# Altium project Brautomation_V2.PrjPcb (part 1 of 2)
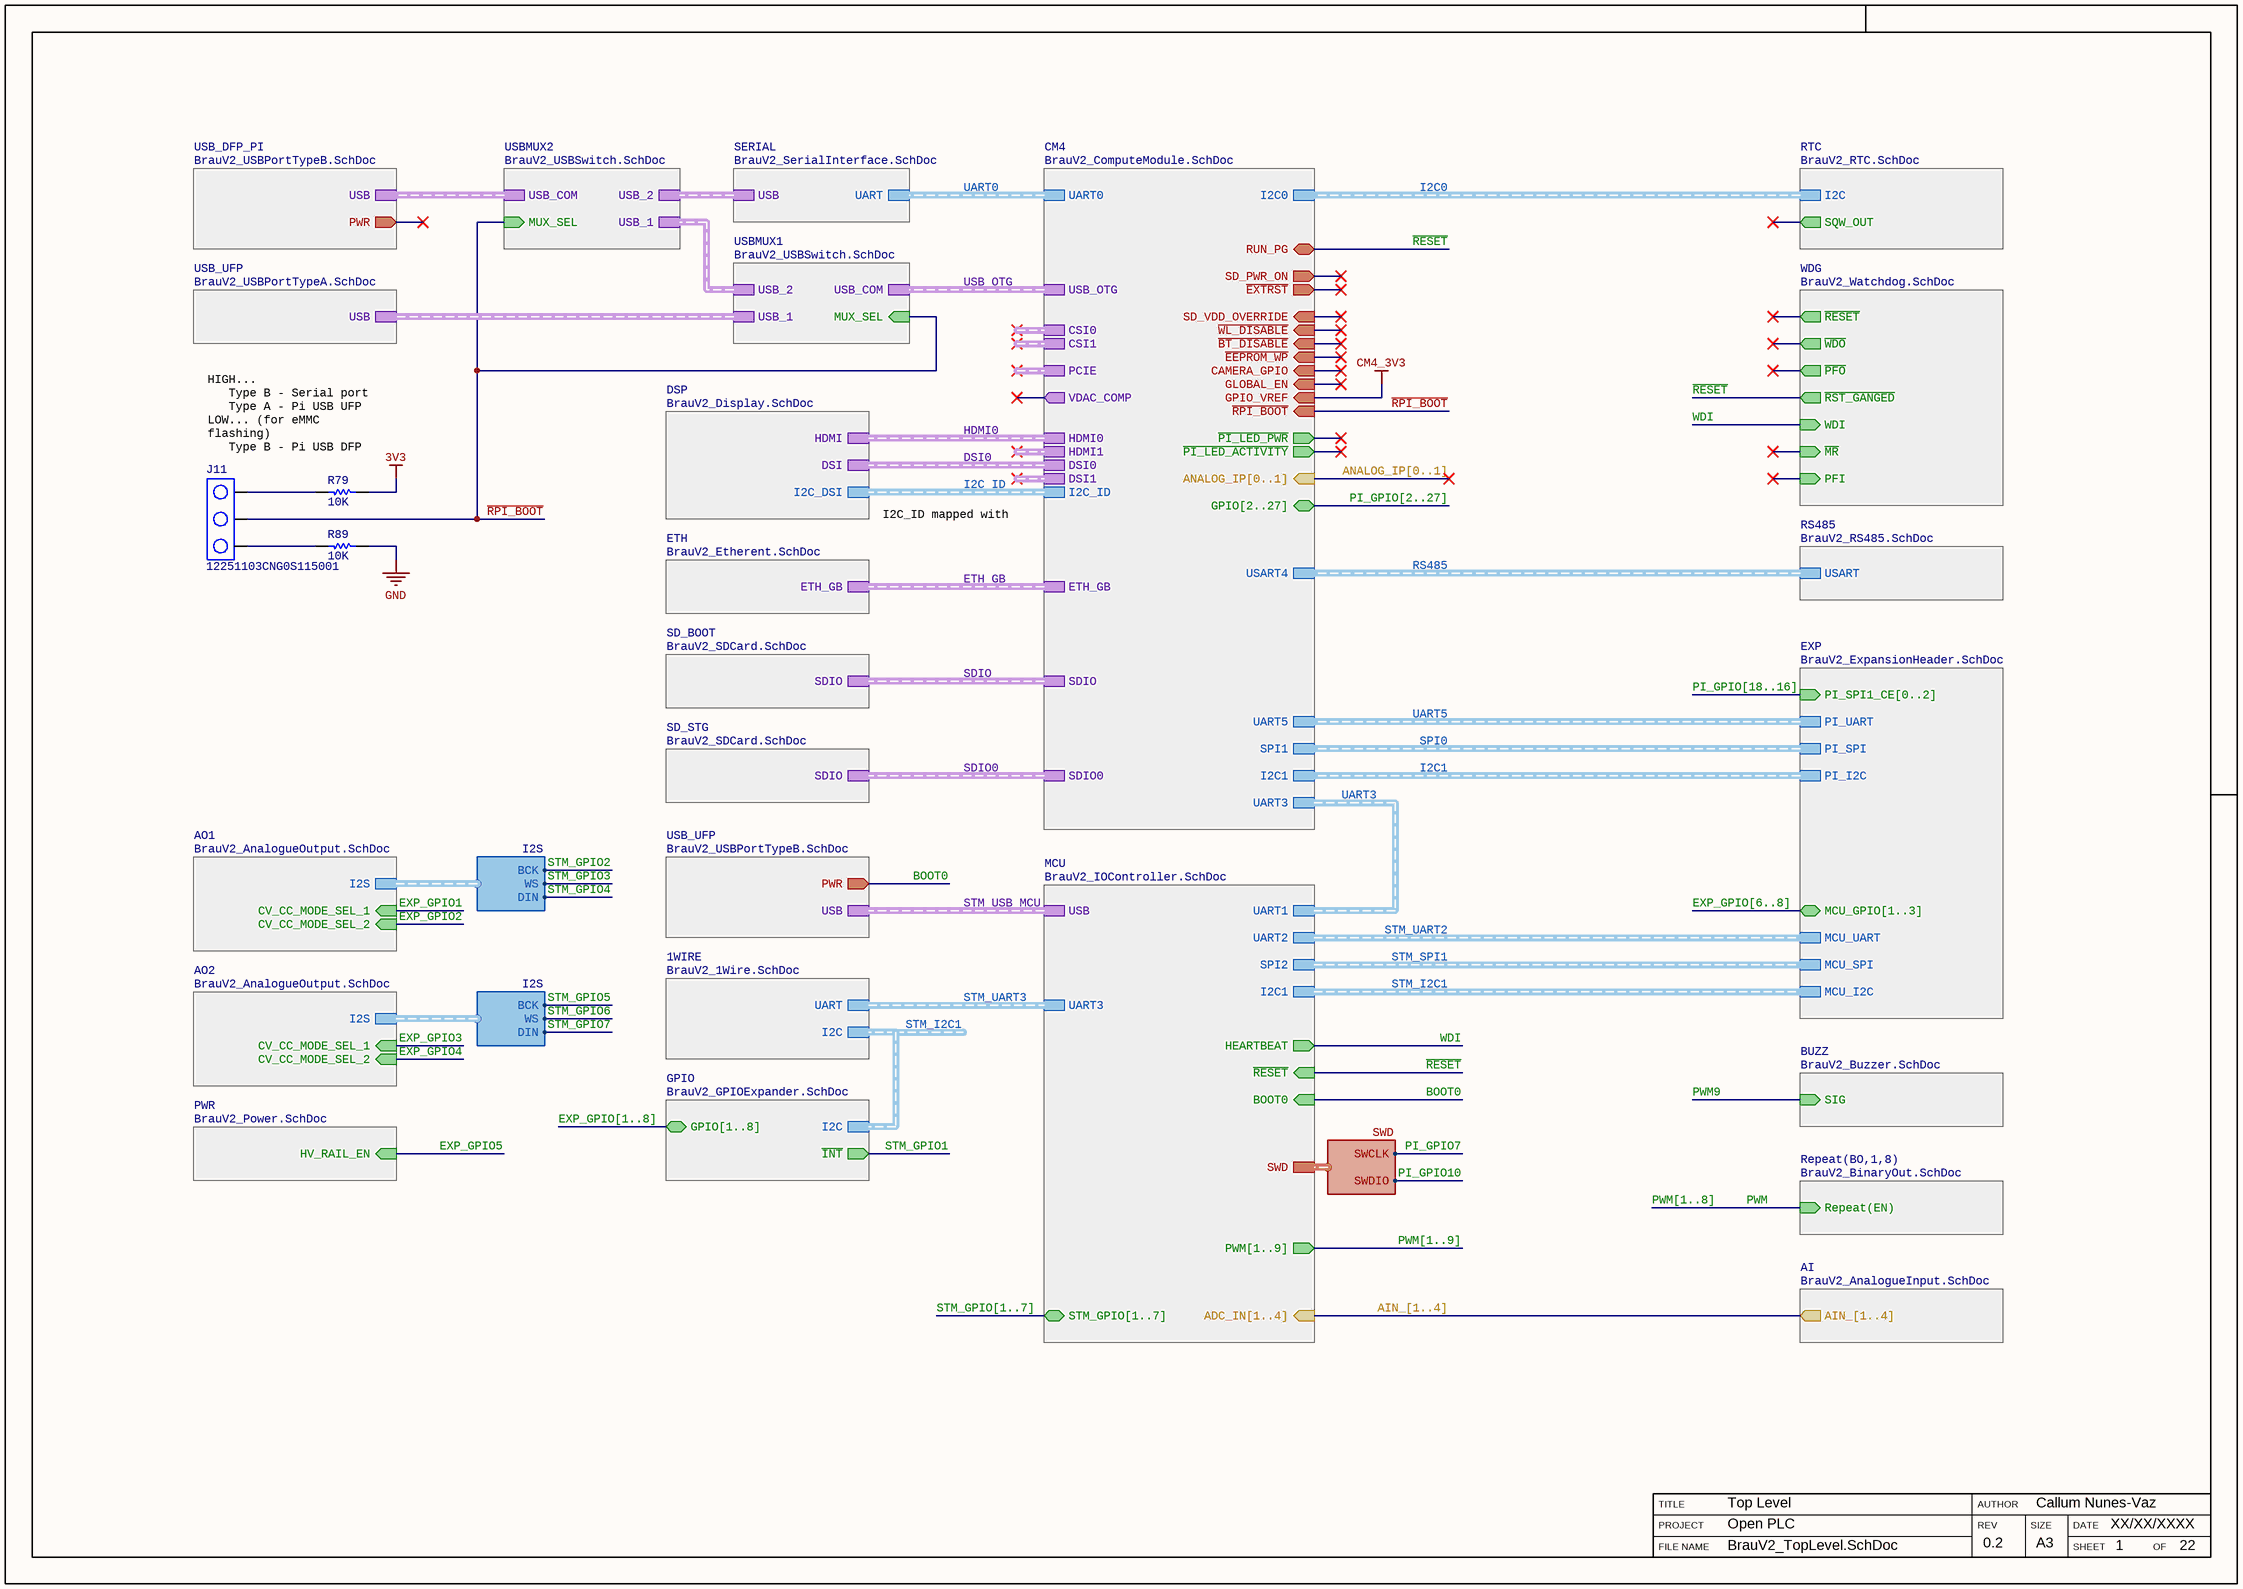
[diagram p0: BrauV2_TopLevel.SchDoc]
ProjectTitle: Open PLC; ProjectRevision: 0.2; ProjectDate: XX/XX/XXXX; AuthorName: Callum Nunes-Vaz
13 sheets, 241 parts. Net scope: hierarchical (ports join the sheet entries above them; power ports are global).
Board files: BrauV2.PcbDoc, BrauV2_PANEL.PcbDoc
Sheets:
  BrauV2_TopLevel.SchDoc
    CM4 = BrauV2_ComputeModule.SchDoc
    AO1 = BrauV2_AnalogueOutput.SchDoc
    AO2 = BrauV2_AnalogueOutput.SchDoc
    MCU = BrauV2_IOController.SchDoc
    USBMUX1 = BrauV2_USBSwitch.SchDoc
    USBMUX2 = BrauV2_USBSwitch.SchDoc
    BUZZ = BrauV2_Buzzer.SchDoc
    AI = BrauV2_AnalogueInput.SchDoc
    DSP = BrauV2_Display.SchDoc
    ETH = BrauV2_Etherent.SchDoc
    PWR = BrauV2_Power.SchDoc
    1WIRE = BrauV2_1Wire.SchDoc
    GPIO = BrauV2_GPIOExpander.SchDoc
    RS485 = BrauV2_RS485.SchDoc

## Sheet BrauV2_TopLevel.SchDoc
size 420 x 297 mm; PageSetup: Record=PageOptions|CenterHorizontal=True|CenterVertical=True|PrintScale=1.01|XCorrection=1.00|YCorrection=1.00|PrintKind=1|BorderSize=5000000|LeftOffset=0|BottomOffset=0|Orientation=2|PaperLength=1000|PaperWidth=1000|Scale=100|PaperSource=7|PrintQuality=-4|MediaType=1|DitherType=10|PaperKind=A3|PrintScaleMode=1; Author: Callum Nunes-Vaz; DocumentNumber: 1; SheetNumber: 1; SheetTotal: 22; SheetTitle: Top Level

### Parts
J11  12251103CNG0S115001  [Header_3POS]
R79  Resistance: 10K  [SMD_RES_0402(1005)_N]  (hidden comment: RC0402FR-0710KL)
R89  Resistance: 10K  [SMD_RES_0402(1005)_N]  (hidden comment: RC0402FR-0710KL)

### Sub-sheets
1WIRE = BrauV2_1Wire.SchDoc: I2C (harness I2C), UART (harness UART)
AI = BrauV2_AnalogueInput.SchDoc: AIN_[1..4] (out)
AO1 = BrauV2_AnalogueOutput.SchDoc: CV_CC_MODE_SEL_1 (in), I2S (harness I2S), CV_CC_MODE_SEL_2 (in)
AO2 = BrauV2_AnalogueOutput.SchDoc: CV_CC_MODE_SEL_1 (in), I2S (harness I2S), CV_CC_MODE_SEL_2 (in)
BUZZ = BrauV2_Buzzer.SchDoc: SIG (in)
CM4 = BrauV2_ComputeModule.SchDoc: ANALOG_IP[0..1] (in), USB_OTG (harness USB), I2C1 (harness I2C), VDAC_COMP (out), PCIE (harness PCIE), CSI1 (harness MIPI_CSI_4L), CSI0 (harness MIPI_CSI_2L), GPIO[2..27] (bidir), RUN_PG (bidir), HDMI0 (harness HDMI), DSI0 (harness MIPI_DSI_2L), SDIO (harness SDIO_X8), HDMI1 (harness HDMI), ETH_GB (harness ETH_GP), DSI1 (harness MIPI_DSI_4L), I2C_ID (harness I2C), UART0 (harness UART), UART3 (harness UART), I2C0 (harness I2C), SDIO0 (harness SDIO_X8), UART5 (harness UART), SPI1 (harness SPI), USART4 (harness USART), SD_PWR_ON (out), ~{EXTRST} (out), GLOBAL_EN (in), ~{RPI_BOOT} (in), CAMERA_GPIO (in), ~{WL_DISABLE} (in), ~{EEPROM_WP} (in), ~{BT_DISABLE} (in), SD_VDD_OVERRIDE (in), GPIO_VREF (in), ~{PI_LED_ACTIVITY} (out), ~{PI_LED_PWR} (out)
DSP = BrauV2_Display.SchDoc: I2C_DSI (harness I2C), HDMI (harness HDMI), DSI (harness MIPI_DSI_4L)
ETH = BrauV2_Etherent.SchDoc: ETH_GB (harness ETH_GP)
EXP = BrauV2_ExpansionHeader.SchDoc (file not in this document): MCU_I2C (harness I2C), MCU_UART (harness UART), MCU_SPI (harness SPI), PI_SPI1_CE[0..2] (in), PI_I2C (harness I2C), PI_UART (harness UART), PI_SPI (harness SPI), MCU_GPIO[1..3] (bidir)
GPIO = BrauV2_GPIOExpander.SchDoc: I2C (harness I2C), GPIO[1..8] (bidir), ~{INT} (out)
MCU = BrauV2_IOController.SchDoc: ADC_IN[1..4] (in), STM_GPIO[1..7] (bidir), UART1 (harness UART), UART2 (harness UART), SPI2 (harness SPI), SWD (harness SWD), PWM[1..9] (out), BOOT0 (in), USB (harness USB), UART3 (harness UART), I2C1 (harness I2C), ~{RESET} (in), HEARTBEAT (out)
PWR = BrauV2_Power.SchDoc: HV_RAIL_EN (in)
Repeat(BO,1,8) = BrauV2_BinaryOut.SchDoc (file not in this document): Repeat(EN) (in)
RS485 = BrauV2_RS485.SchDoc: USART (harness USART)
RTC = BrauV2_RTC.SchDoc (file not in this document): SQW_OUT (out), I2C (harness I2C)
SD_BOOT = BrauV2_SDCard.SchDoc (file not in this document): SDIO (harness SDIO_X8)
SD_STG = BrauV2_SDCard.SchDoc (file not in this document): SDIO (harness SDIO_X8)
SERIAL = BrauV2_SerialInterface.SchDoc (file not in this document): UART (harness UART), USB (harness USB)
USB_DFP_PI = BrauV2_USBPortTypeB.SchDoc (file not in this document): USB (harness USB), PWR (out)
USB_UFP = BrauV2_USBPortTypeA.SchDoc (file not in this document): USB (harness USB)
USB_UFP = BrauV2_USBPortTypeB.SchDoc (file not in this document): USB (harness USB), PWR (out)
USBMUX1 = BrauV2_USBSwitch.SchDoc: USB_COM (harness USB), USB_1 (harness USB), USB_2 (harness USB), MUX_SEL (in)
USBMUX2 = BrauV2_USBSwitch.SchDoc: USB_COM (harness USB), USB_1 (harness USB), USB_2 (harness USB), MUX_SEL (in)
WDG = BrauV2_Watchdog.SchDoc (file not in this document): PFI (in), ~{MR} (in), WDI (in), ~{PFO} (out), ~{WDO} (out), ~{RESET} (out), ~{RST_GANGED} (out)

### Harnesses
SWD: SWCLK, SWDIO
I2S: WS, BCK, DIN

### Nets
3V3: R79.2
GND: R89.1
BOOT0: sheet MCU/BOOT0, sheet USB_UFP/PWR
PWM: sheet Repeat(BO,1,8)/Repeat(EN)
~{RESET}: sheet CM4/RUN_PG, sheet MCU/~{RESET}, sheet WDG/~{RST_GANGED}
~{RPI_BOOT}: J11.2 ; sheet CM4/~{RPI_BOOT}, sheet USBMUX1/MUX_SEL, sheet USBMUX2/MUX_SEL  [project net MUX_SEL]
WDI: sheet MCU/HEARTBEAT, sheet WDG/WDI  [project net LED]
NetJ11_1: J11.1 R79.1
NetJ11_3: J11.3 R89.2

### Buses and harness runs
bus AIN_[1..4] = sheet AI/AIN_[1..4] = sheet MCU/ADC_IN[1..4]
bus ANALOG_IP[0..1] = sheet CM4/ANALOG_IP[0..1]
bus EXP_GPIO[1..8] = sheet GPIO/GPIO[1..8]
bus EXP_GPIO[6..8] = sheet EXP/MCU_GPIO[1..3]
bus PI_GPIO[2..27] = sheet CM4/GPIO[2..27]
bus PI_GPIO[18..16] = sheet EXP/PI_SPI1_CE[0..2]
bus PWM[1..8]
bus PWM[1..9] = sheet MCU/PWM[1..9]
bus STM_GPIO[1..7] = sheet MCU/STM_GPIO[1..7]
harness DSI0 = sheet CM4/DSI0 = sheet DSP/DSI
harness ETH_GB = sheet CM4/ETH_GB = sheet ETH/ETH_GB
harness HDMI0 = sheet CM4/HDMI0 = sheet DSP/HDMI
harness I2C0 = sheet CM4/I2C0 = sheet RTC/I2C
harness I2C1 = sheet CM4/I2C1 = sheet EXP/PI_I2C
harness I2C_ID = sheet CM4/I2C_ID = sheet DSP/I2C_DSI
harness RS485 = sheet CM4/USART4 = sheet RS485/USART
harness SDIO0 = sheet CM4/SDIO0 = sheet SD_STG/SDIO
harness SDIO = sheet CM4/SDIO = sheet SD_BOOT/SDIO
harness sheet SERIAL/USB = sheet USBMUX2/USB_2
harness sheet USB_DFP_PI/USB = sheet USBMUX2/USB_COM
harness sheet USB_UFP/USB = sheet USBMUX1/USB_1
harness sheet USBMUX1/USB_2 = sheet USBMUX2/USB_1
harness SPI0 = sheet CM4/SPI1 = sheet EXP/PI_SPI
harness STM_I2C1 = sheet 1WIRE/I2C = sheet GPIO/I2C
harness STM_I2C1 = sheet EXP/MCU_I2C = sheet MCU/I2C1
harness STM_SPI1 = sheet EXP/MCU_SPI = sheet MCU/SPI2
harness STM_UART2 = sheet EXP/MCU_UART = sheet MCU/UART2
harness STM_UART3 = sheet 1WIRE/UART = sheet MCU/UART3
harness STM_USB_MCU = sheet MCU/USB = sheet USB_UFP/USB
harness UART0 = sheet CM4/UART0 = sheet SERIAL/UART
harness UART3 = sheet CM4/UART3 = sheet MCU/UART1
harness UART5 = sheet CM4/UART5 = sheet EXP/PI_UART
harness USB_OTG = sheet CM4/USB_OTG = sheet USBMUX1/USB_COM

### Notes on the sheet
- HIGH...
  Type B - Serial port
  Type A - Pi USB UFP
  LOW... (for eMMC flashing)
  Type B - Pi USB DFP
  Type A - disconnected
- I2C_ID mapped with DSI0
- FILE NAME
- PROJECT
- TITLE
- REV
- AUTHOR
- SIZE
- SHEET
- DATE
- OF
- A3

### Library data of the parts
J11 = 3-way Jumper: Pin Header 3 1 right-angle，180degrees 2.54mm Through Hole,P=2.54mm Pin Header & Female Header RoHS
R79 R89 = 10K 0402 1% 1/16W: 10kΩ ±1% 1/16W ±100ppm/℃ 0402 Chip Resistor - Surface Mount RoHS; Package: 0402; Tolerance: 1%; Power Rating: 1/16W

## Sheet BrauV2_ComputeModule.SchDoc
size 420 x 297 mm; PageSetup: Record=PageOptions|CenterHorizontal=True|CenterVertical=True|PrintScale=1.01|XCorrection=1.00|YCorrection=1.00|PrintKind=1|BorderSize=5000000|LeftOffset=0|BottomOffset=0|Orientation=2|PaperLength=1000|PaperWidth=1000|Scale=100|PaperSource=7|PrintQuality=-4|MediaType=1|DitherType=10|PaperKind=A3|PrintScaleMode=1; DocumentNumber: 2; SheetNumber: 2; SheetTotal: 22
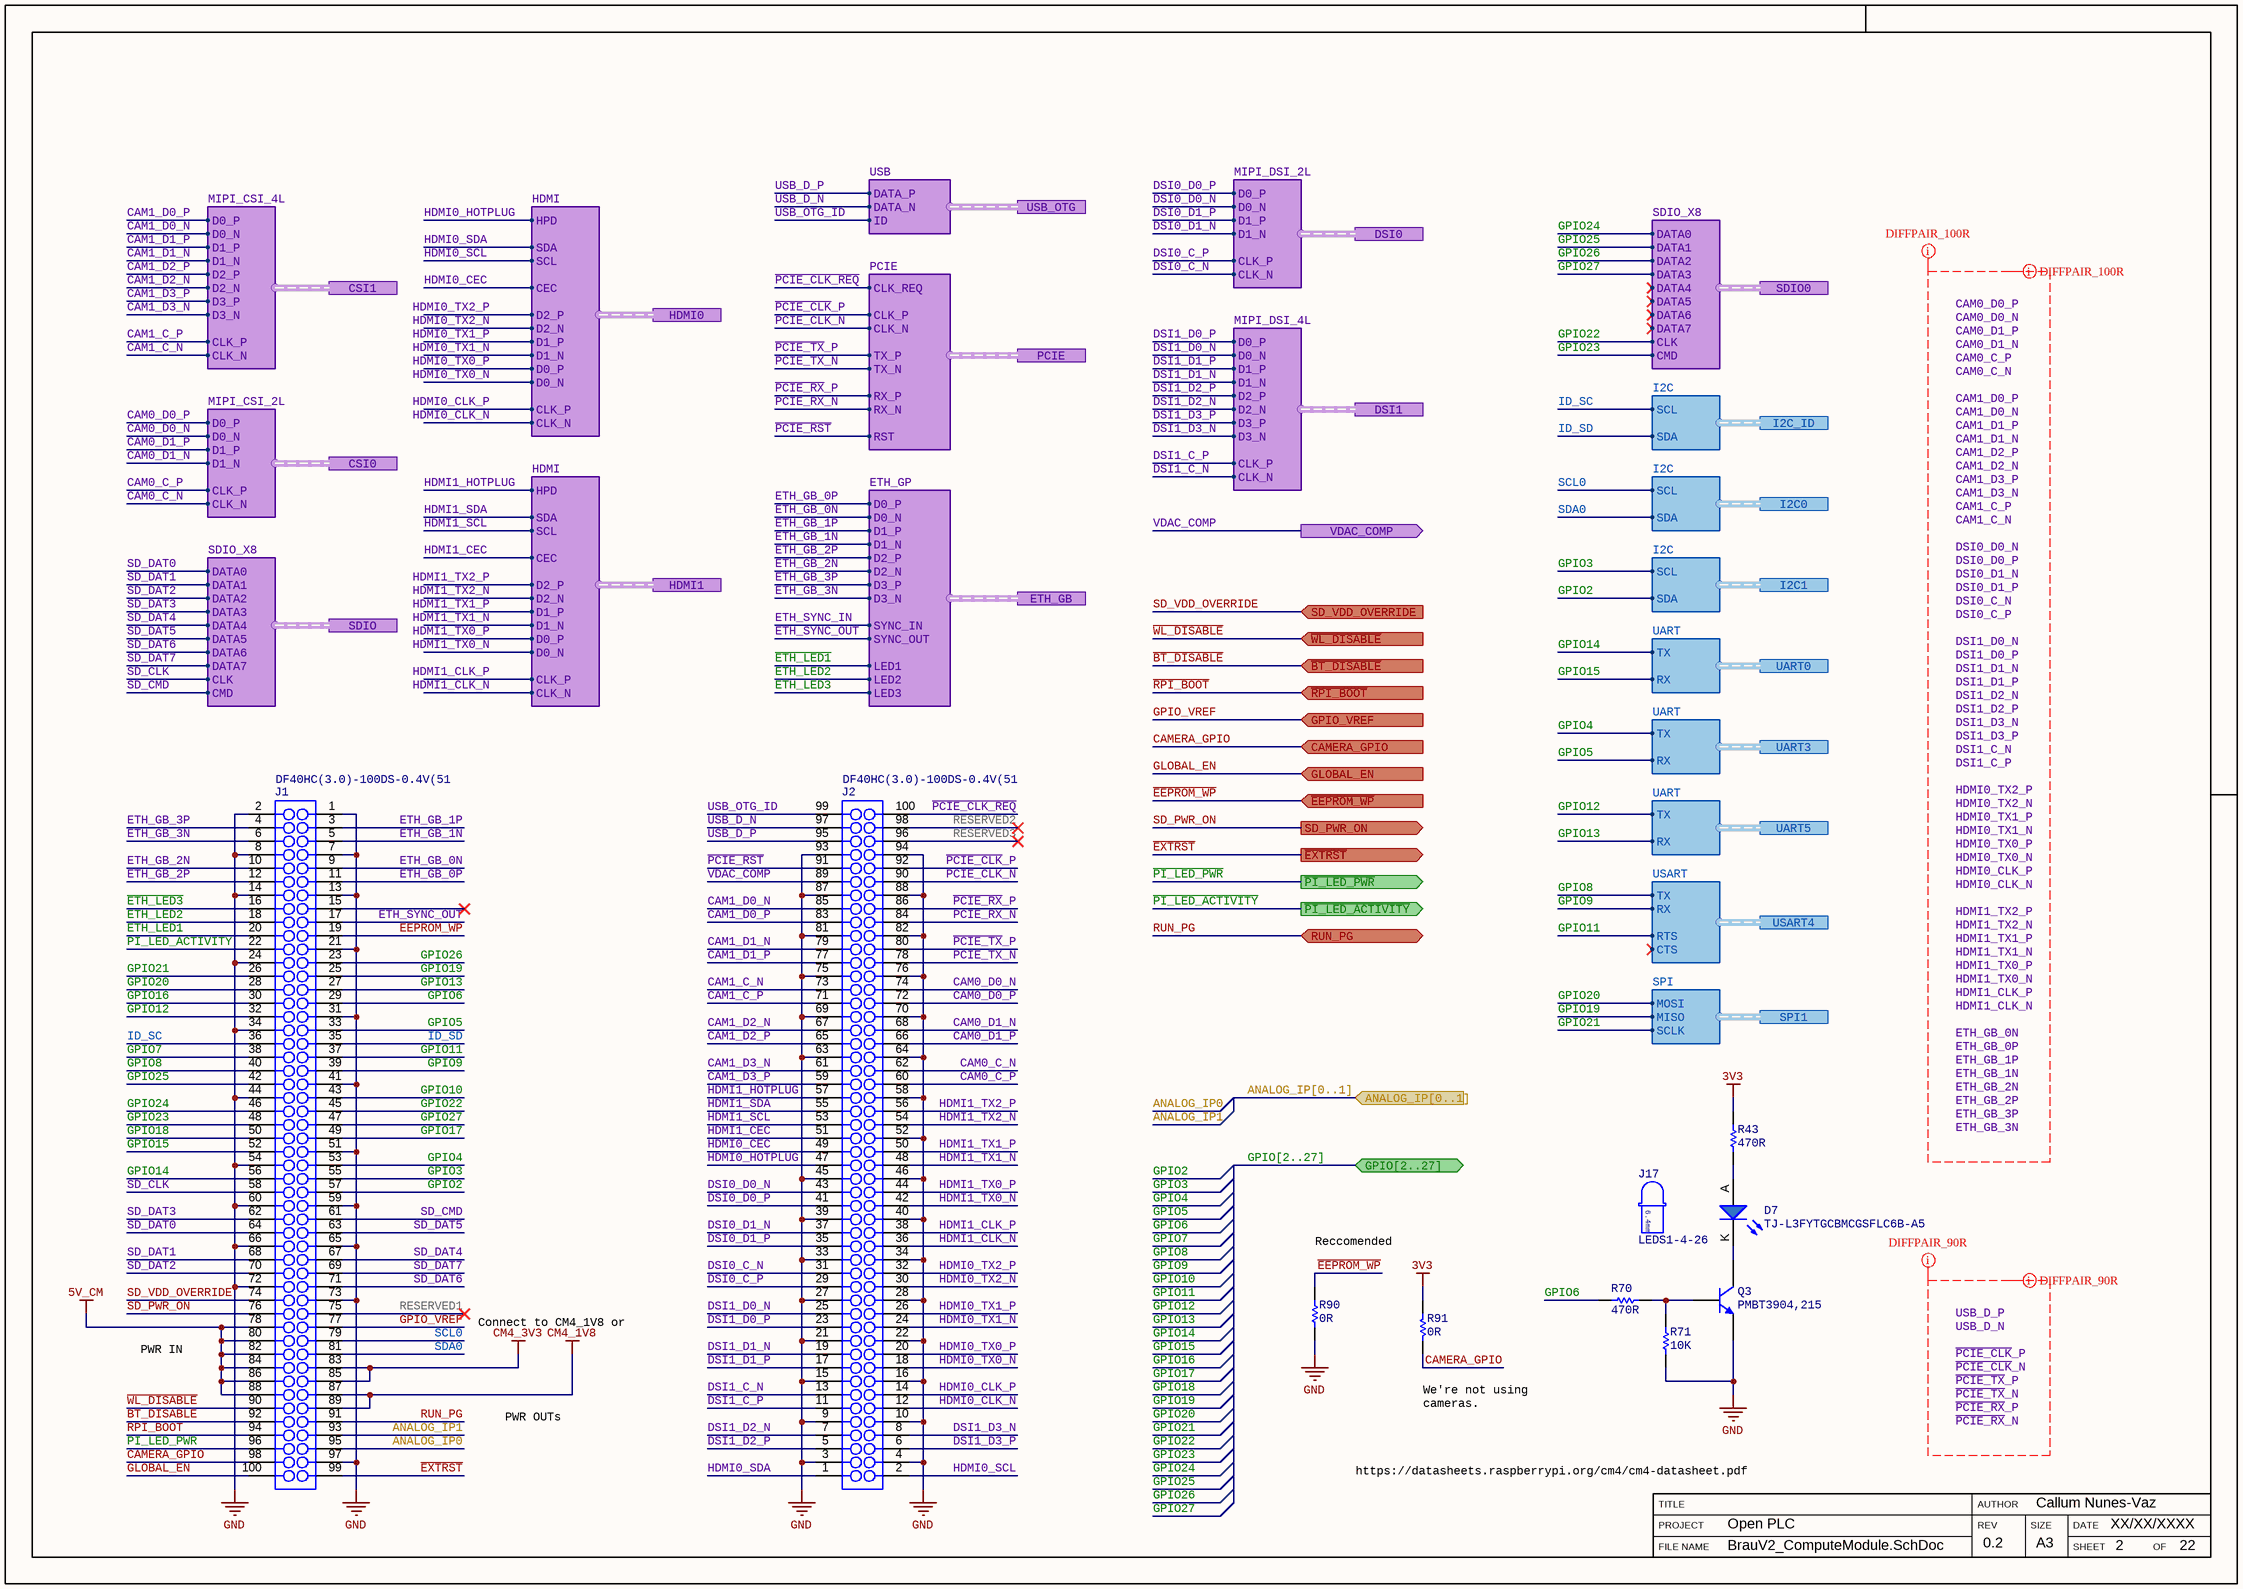
[diagram p1: BrauV2_ComputeModule.SchDoc]

### Parts
D7  TJ-L3FYTGCBMCGSFLC6B-A5  [LED_3MM_SPACED_6.4MM_BLUE]
J1  DF40HC(3.0)-100DS-0.4V(51  [DF40HC(3.0)-100DS-0.4V(51-Footprint-1]
J2  DF40HC(3.0)-100DS-0.4V(51  [DF40HC(3.0)-100DS-0.4V(51-Footprint-1]
J17  LEDS1-4-26  [3MM_LED_SPACER_6.4MM]
Q3  PMBT3904,215  [SOT23-3]
R43  Resistance: 470R  [SMD_RES_0402(1005)_N]  (hidden comment: RC0402FR-07470RL)
R70  Resistance: 470R  [SMD_RES_0402(1005)_N]  (hidden comment: RC0402FR-07470RL)
R71  Resistance: 10K  [SMD_RES_0402(1005)_N]  (hidden comment: RC0402FR-0710KL)
R90  Resistance: 0R  [SMD_RES_0402(1005)_N]  (hidden comment: RC0402FR-070RL)
R91  Resistance: 0R  [SMD_RES_0402(1005)_N]  (hidden comment: RC0402FR-070RL)

### Ports
ANALOG_IP[0..1] (in), CAMERA_GPIO (in), CSI0 (harness MIPI_CSI_2L), CSI1 (harness MIPI_CSI_4L), DSI0 (harness MIPI_DSI_2L), DSI1 (harness MIPI_DSI_4L), ETH_GB (harness ETH_GP), GLOBAL_EN (in), GPIO[2..27] (bidir), GPIO_VREF (in), HDMI0 (harness HDMI), HDMI1 (harness HDMI), I2C0 (harness I2C), I2C1 (harness I2C), I2C_ID (harness I2C), PCIE (harness PCIE), RUN_PG (bidir), SD_PWR_ON (out), SD_VDD_OVERRIDE (in), SDIO0 (harness SDIO_X8), SDIO (harness SDIO_X8), SPI1 (harness SPI), UART0 (harness UART), UART3 (harness UART), UART5 (harness UART), USART4 (harness USART), USB_OTG (harness USB), VDAC_COMP (out), ~{BT_DISABLE} (in), ~{EEPROM_WP} (in), ~{EXTRST} (out), ~{PI_LED_ACTIVITY} (out), ~{PI_LED_PWR} (out), ~{RPI_BOOT} (in), ~{WL_DISABLE} (in)

### Harnesses
USB: DATA_P, DATA_N, ID
MIPI_CSI_4L: D1_N, D1_P, D0_P, D0_N, CLK_P, CLK_N, D2_N, D2_P, D3_N, D3_P
MIPI_CSI_2L: D1_N, D1_P, D0_P, D0_N, CLK_P, CLK_N
SDIO_X8: DATA1, DATA0, DATA2, DATA3, DATA4, DATA5, DATA6, CMD, CLK, DATA7
HDMI: CLK_P, CLK_N, D0_P, D0_N, D2_N, D2_P, D1_N, D1_P, CEC, HPD, SDA, SCL
PCIE: CLK_P, CLK_N, TX_P, TX_N, RX_P, RX_N, CLK_REQ, RST
ETH_GP: D0_P, D0_N, D1_P, D1_N, D2_P, D2_N, D3_P, D3_N, SYNC_IN, SYNC_OUT, LED1, LED2, LED3
MIPI_DSI_4L: D1_N, D1_P, D0_P, D0_N, CLK_P, CLK_N, D2_N, D2_P, D3_N, D3_P
MIPI_DSI_2L: D1_N, D1_P, D0_P, D0_N, CLK_P, CLK_N
I2C: SCL, SDA
UART: TX, RX
SPI: MOSI, MISO, SCLK
USART: TX, RX, RTS, CTS

### Nets
3V3: R43.1 R91.1
5V_CM: J1.78 J1.80 J1.82 J1.84 J1.86 J1.88
CM4_1V8: J1.87 J1.89
GND: J1.1 J1.2 J1.7 J1.8 J1.13 J1.14 J1.21 J1.24 J1.31 J1.34 J1.41 J1.44 J1.51 J1.54 J1.59 J1.60 J1.65 J1.66 J1.72 J1.73 J1.97 J2.3 J2.4 J2.9 J2.10 J2.15 J2.16 J2.21 J2.22 J2.27 J2.28 J2.33 J2.34 J2.39 J2.40 J2.45 J2.46 J2.52 J2.58 J2.63 J2.64 J2.69 J2.70 J2.75 J2.76 J2.81 J2.82 J2.87 J2.88 J2.93 J2.94 Q3.2(E) R71.1 R90.1
GPIO_VREF: J1.77 J1.83 J1.85 ; port GPIO_VREF  [also labelled CM4_3V3]
ANALOG_IP0: J1.95
ANALOG_IP1: J1.93
~{BT_DISABLE}: J1.92 ; port ~{BT_DISABLE}
CAM0_C_N: J2.62 ; port CSI0.CLK_N
CAM0_C_P: J2.60 ; port CSI0.CLK_P
CAM0_D0_N: J2.74 ; port CSI0.D0_N
CAM0_D0_P: J2.72 ; port CSI0.D0_P
CAM0_D1_N: J2.68 ; port CSI0.D1_N
CAM0_D1_P: J2.66 ; port CSI0.D1_P
CAM1_C_N: J2.73 ; port CSI1.CLK_N
CAM1_C_P: J2.71 ; port CSI1.CLK_P
CAM1_D0_N: J2.85 ; port CSI1.D0_N
CAM1_D0_P: J2.83 ; port CSI1.D0_P
CAM1_D1_N: J2.79 ; port CSI1.D1_N
CAM1_D1_P: J2.77 ; port CSI1.D1_P
CAM1_D2_N: J2.67 ; port CSI1.D2_N
CAM1_D2_P: J2.65 ; port CSI1.D2_P
CAM1_D3_N: J2.61 ; port CSI1.D3_N
CAM1_D3_P: J2.59 ; port CSI1.D3_P
CAMERA_GPIO: J1.98 R91.2 ; port CAMERA_GPIO
DSI0_C_N: J2.31 ; port DSI0.CLK_N  [project net DSI.CLK_N]
DSI0_C_P: J2.29 ; port DSI0.CLK_P  [project net DSI.CLK_P]
DSI0_D0_N: J2.43 ; port DSI0.D0_N  [project net DSI.D0_N]
DSI0_D0_P: J2.41 ; port DSI0.D0_P  [project net DSI.D0_P]
DSI0_D1_N: J2.37 ; port DSI0.D1_N  [project net DSI.D1_N]
DSI0_D1_P: J2.35 ; port DSI0.D1_P  [project net DSI.D1_P]
DSI1_C_N: J2.13 ; port DSI1.CLK_N
DSI1_C_P: J2.11 ; port DSI1.CLK_P
DSI1_D0_N: J2.25 ; port DSI1.D0_N
DSI1_D0_P: J2.23 ; port DSI1.D0_P
DSI1_D1_N: J2.19 ; port DSI1.D1_N
DSI1_D1_P: J2.17 ; port DSI1.D1_P
DSI1_D2_N: J2.7 ; port DSI1.D2_N
DSI1_D2_P: J2.5 ; port DSI1.D2_P
DSI1_D3_N: J2.8 ; port DSI1.D3_N
DSI1_D3_P: J2.6 ; port DSI1.D3_P
~{EEPROM_WP}: J1.19 R90.2 ; port ~{EEPROM_WP}
~{ETH_LED1}: J1.20 ; port ETH_GB.LED1
~{ETH_LED2}: J1.18 ; port ETH_GB.LED2
~{ETH_LED3}: J1.16 ; port ETH_GB.LED3
~{EXTRST}: J1.99 ; port ~{EXTRST}
ETH_GB_0N: J1.9 ; port ETH_GB.D0_N  [project net ETH_GB.D0_N]
ETH_GB_0P: J1.11 ; port ETH_GB.D0_P  [project net ETH_GB.D0_P]
ETH_GB_1N: J1.5 ; port ETH_GB.D1_N  [project net ETH_GB.D1_N]
ETH_GB_1P: J1.3 ; port ETH_GB.D1_P  [project net ETH_GB.D1_P]
ETH_GB_2N: J1.10 ; port ETH_GB.D2_N  [project net ETH_GB.D2_N]
ETH_GB_2P: J1.12 ; port ETH_GB.D2_P  [project net ETH_GB.D2_P]
ETH_GB_3N: J1.6 ; port ETH_GB.D3_N  [project net ETH_GB.D3_N]
ETH_GB_3P: J1.4 ; port ETH_GB.D3_P  [project net ETH_GB.D3_P]
ETH_SYNC_IN: port ETH_GB.SYNC_IN  [project net ETH_GB.SYNC_IN]
ETH_SYNC_OUT: J1.17 ; port ETH_GB.SYNC_OUT  [project net ETH_GB.SYNC_OUT]
GLOBAL_EN: J1.100 ; port GLOBAL_EN
GPIO2: J1.57 ; port I2C1.SDA
GPIO3: J1.55 ; port I2C1.SCL
GPIO4: J1.53 ; port UART3.TX
GPIO5: J1.33 ; port UART3.RX
GPIO6: J1.29 R70.2
GPIO7: J1.38
GPIO8: J1.40 ; port USART4.TX
GPIO9: J1.39 ; port USART4.RX
GPIO10: J1.43
GPIO11: J1.37 ; port USART4.RTS  [project net DIR]
GPIO12: J1.32 ; port UART5.TX
GPIO13: J1.27 ; port UART5.RX
GPIO14: J1.56 ; port UART0.TX
GPIO15: J1.52 ; port UART0.RX
GPIO16: J1.30
GPIO17: J1.49
GPIO18: J1.50
GPIO19: J1.25 ; port SPI1.MISO
GPIO20: J1.28 ; port SPI1.MOSI
GPIO21: J1.26 ; port SPI1.SCLK
GPIO22: J1.45 ; port SDIO0.CLK
GPIO23: J1.48 ; port SDIO0.CMD
GPIO24: J1.46 ; port SDIO0.DATA0
GPIO25: J1.42 ; port SDIO0.DATA1
GPIO26: J1.23 ; port SDIO0.DATA2
GPIO27: J1.47 ; port SDIO0.DATA3
HDMI0_CEC: J2.49 ; port HDMI0.CEC  [project net HDMI.CEC]
HDMI0_CLK_N: J2.12 ; port HDMI0.CLK_N  [project net HDMI.CLK_N]
HDMI0_CLK_P: J2.14 ; port HDMI0.CLK_P  [project net HDMI.CLK_P]
HDMI0_HOTPLUG: J2.47 ; port HDMI0.HPD  [project net HDMI.HPD]
HDMI0_SCL: J2.2 ; port HDMI0.SCL  [project net HDMI.SCL]
HDMI0_SDA: J2.1 ; port HDMI0.SDA  [project net HDMI.SDA]
HDMI0_TX0_N: J2.18 ; port HDMI0.D0_N  [project net HDMI.D0_N]
HDMI0_TX0_P: J2.20 ; port HDMI0.D0_P  [project net HDMI.D0_P]
HDMI0_TX1_N: J2.24 ; port HDMI0.D1_N  [project net HDMI.D1_N]
HDMI0_TX1_P: J2.26 ; port HDMI0.D1_P  [project net HDMI.D1_P]
HDMI0_TX2_N: J2.30 ; port HDMI0.D2_N  [project net HDMI.D2_N]
HDMI0_TX2_P: J2.32 ; port HDMI0.D2_P  [project net HDMI.D2_P]
HDMI1_CEC: J2.51 ; port HDMI1.CEC
HDMI1_CLK_N: J2.36 ; port HDMI1.CLK_N
HDMI1_CLK_P: J2.38 ; port HDMI1.CLK_P
HDMI1_HOTPLUG: J2.57 ; port HDMI1.HPD
HDMI1_SCL: J2.53 ; port HDMI1.SCL
HDMI1_SDA: J2.55 ; port HDMI1.SDA
HDMI1_TX0_N: J2.42 ; port HDMI1.D0_N
HDMI1_TX0_P: J2.44 ; port HDMI1.D0_P
HDMI1_TX1_N: J2.48 ; port HDMI1.D1_N
HDMI1_TX1_P: J2.50 ; port HDMI1.D1_P
HDMI1_TX2_N: J2.54 ; port HDMI1.D2_N
HDMI1_TX2_P: J2.56 ; port HDMI1.D2_P
ID_SC: J1.36 ; port I2C_ID.SCL  [project net I2C_DSI.SCL]
ID_SD: J1.35 ; port I2C_ID.SDA  [project net I2C_DSI.SDA]
~{PCIE_CLK_REQ}: J2.100 ; port PCIE.CLK_REQ
~{PCIE_CLK}_N: J2.90 ; port PCIE.CLK_N
~{PCIE_CLK}_P: J2.92 ; port PCIE.CLK_P
~{PCIE_RST}: J2.91 ; port PCIE.RST
~{PCIE_RX}_N: J2.84 ; port PCIE.RX_N
~{PCIE_RX}_P: J2.86 ; port PCIE.RX_P
~{PCIE_TX}_N: J2.78 ; port PCIE.TX_N
~{PCIE_TX}_P: J2.80 ; port PCIE.TX_P
~{PI_LED_ACTIVITY}: J1.22 ; port ~{PI_LED_ACTIVITY}
~{PI_LED_PWR}: J1.96 ; port ~{PI_LED_PWR}
~{RPI_BOOT}: J1.94 ; port ~{RPI_BOOT}  [project net MUX_SEL]
RESERVED1: J1.75
RESERVED2: J2.98
RESERVED3: J2.96
RUN_PG: J1.91 ; port RUN_PG  [project net ~{RESET}]
SCL0: J1.79 ; port I2C0.SCL  [project net I2C0.SCL]
SD_CLK: J1.58 ; port SDIO.CLK
SD_CMD: J1.61 ; port SDIO.CMD
SD_DAT0: J1.64 ; port SDIO.DATA0
SD_DAT1: J1.68 ; port SDIO.DATA1
SD_DAT2: J1.70 ; port SDIO.DATA2
SD_DAT3: J1.62 ; port SDIO.DATA3
SD_DAT4: J1.67 ; port SDIO.DATA4
SD_DAT5: J1.63 ; port SDIO.DATA5
SD_DAT6: J1.71 ; port SDIO.DATA6
SD_DAT7: J1.69 ; port SDIO.DATA7
SD_PWR_ON: J1.76 ; port SD_PWR_ON
SD_VDD_OVERRIDE: J1.74 ; port SD_VDD_OVERRIDE
SDA0: J1.81 ; port I2C0.SDA  [project net I2C0.SDA]
USB_D_N: J2.97 ; port USB_OTG.DATA_N  [project net USB_COM_D_N]
USB_D_P: J2.95 ; port USB_OTG.DATA_P  [project net USB_COM_D_P]
USB_OTG_ID: J2.99 ; port USB_OTG.ID  [project net USB_OTG.ID]
VDAC_COMP: J2.89 ; port VDAC_COMP
~{WL_DISABLE}: J1.90 ; port ~{WL_DISABLE}
NetD7_A: D7.A R43.2
NetD7_K: D7.K Q3.3(C)
NetQ3_1: Q3.1(B) R70.1 R71.2

Not connected (* = marked no-connect by the designer): J1 15*

### Buses and harness runs
bus ANALOG_IP[0..1] = port ANALOG_IP[0..1]
bus GPIO[2..27] = port GPIO[2..27]

### Layout directives
differential pair; differential pair class 90R_DIFF_PAIRS; net class 90R_PAIRS: USB_D_N, USB_D_P, ~{PCIE_CLK}_N, ~{PCIE_CLK}_P, ~{PCIE_RX}_N, ~{PCIE_RX}_P, ~{PCIE_TX}_N, ~{PCIE_TX}_P
differential pair; differential pair class 100R_DIFF_PAIRS; net class 100R_PAIRS: CAM0_C_N, CAM0_C_P, CAM0_D0_N, CAM0_D0_P, CAM0_D1_N, CAM0_D1_P, CAM1_C_N, CAM1_C_P, CAM1_D0_N, CAM1_D0_P, CAM1_D1_N, CAM1_D1_P, CAM1_D2_N, CAM1_D2_P, CAM1_D3_N, CAM1_D3_P, DSI0_C_N, DSI0_C_P, DSI0_D0_N, DSI0_D0_P, DSI0_D1_N, DSI0_D1_P, DSI1_C_N, DSI1_C_P, DSI1_D0_N, DSI1_D0_P, DSI1_D1_N, DSI1_D1_P, DSI1_D2_N, DSI1_D2_P, DSI1_D3_N, DSI1_D3_P, ETH_GB_0N, ETH_GB_0P, ETH_GB_1N, ETH_GB_1P, ETH_GB_2N, ETH_GB_2P, ETH_GB_3N, ETH_GB_3P, HDMI0_CLK_N, HDMI0_CLK_P, HDMI0_TX0_N, HDMI0_TX0_P, HDMI0_TX1_N, HDMI0_TX1_P, HDMI0_TX2_N, HDMI0_TX2_P, HDMI1_CLK_N, HDMI1_CLK_P, HDMI1_TX0_N, HDMI1_TX0_P, HDMI1_TX1_N, HDMI1_TX1_P, HDMI1_TX2_N, HDMI1_TX2_P
mark named DIFFPAIR_100R: CAM0_C_N, CAM0_C_P, CAM0_D0_N, CAM0_D0_P, CAM0_D1_N, CAM0_D1_P, CAM1_C_N, CAM1_C_P, CAM1_D0_N, CAM1_D0_P, CAM1_D1_N, CAM1_D1_P, CAM1_D2_N, CAM1_D2_P, CAM1_D3_N, CAM1_D3_P, DSI0_C_N, DSI0_C_P, DSI0_D0_N, DSI0_D0_P, DSI0_D1_N, DSI0_D1_P, DSI1_C_N, DSI1_C_P, DSI1_D0_N, DSI1_D0_P, DSI1_D1_N, DSI1_D1_P, DSI1_D2_N, DSI1_D2_P, DSI1_D3_N, DSI1_D3_P, ETH_GB_0N, ETH_GB_0P, ETH_GB_1N, ETH_GB_1P, ETH_GB_2N, ETH_GB_2P, ETH_GB_3N, ETH_GB_3P, HDMI0_CLK_N, HDMI0_CLK_P, HDMI0_TX0_N, HDMI0_TX0_P, HDMI0_TX1_N, HDMI0_TX1_P, HDMI0_TX2_N, HDMI0_TX2_P, HDMI1_CLK_N, HDMI1_CLK_P, HDMI1_TX0_N, HDMI1_TX0_P, HDMI1_TX1_N, HDMI1_TX1_P, HDMI1_TX2_N, HDMI1_TX2_P
mark named DIFFPAIR_90R: USB_D_N, USB_D_P, ~{PCIE_CLK}_N, ~{PCIE_CLK}_P, ~{PCIE_RX}_N, ~{PCIE_RX}_P, ~{PCIE_TX}_N, ~{PCIE_TX}_P

### Notes on the sheet
- Reccomended
- Connect to CM4_1V8 or CM4_3V3
- PWR IN
- (near R91) We're not using cameras.
- PWR OUTs
- https://datasheets.raspberrypi.org/cm4/cm4-datasheet.pdf
- Labels drawn without touching a wire or pin: CAM0_C_N, CAM0_C_P, CAM0_D0_N, CAM0_D0_P, CAM0_D1_N, CAM0_D1_P, CAM1_C_N, CAM1_C_P, CAM1_D0_N, CAM1_D0_P, CAM1_D1_N, CAM1_D1_P, CAM1_D2_N, CAM1_D2_P, CAM1_D3_N, CAM1_D3_P, DSI0_C_N, DSI0_C_P, DSI0_D0_N, DSI0_D0_P, DSI0_D1_N, DSI0_D1_P, DSI1_C_N, DSI1_C_P, DSI1_D0_N, DSI1_D0_P, DSI1_D1_N, DSI1_D1_P, DSI1_D2_N, DSI1_D2_P, DSI1_D3_N, DSI1_D3_P, ETH_GB_0N, ETH_GB_0P, ETH_GB_1N, ETH_GB_1P, ETH_GB_2N, ETH_GB_2P, ETH_GB_3N, ETH_GB_3P, HDMI0_CLK_N, HDMI0_CLK_P, HDMI0_TX0_N, HDMI0_TX0_P, HDMI0_TX1_N, HDMI0_TX1_P, HDMI0_TX2_N, HDMI0_TX2_P, HDMI1_CLK_N, HDMI1_CLK_P, HDMI1_TX0_N, HDMI1_TX0_P, HDMI1_TX1_N, HDMI1_TX1_P, HDMI1_TX2_N, HDMI1_TX2_P, USB_D_N, USB_D_P, ~{PCIE_CLK}_N, ~{PCIE_CLK}_P, ~{PCIE_RX}_N, ~{PCIE_RX}_P, ~{PCIE_TX}_N, ~{PCIE_TX}_P
- FILE NAME
- PROJECT
- TITLE
- REV
- AUTHOR
- SIZE
- SHEET
- DATE
- OF
- A3
- (in symbol LEDS1-4-26) 6.4mm

### Library data of the parts
D7 = TJ-L3FYTGCBMCGSFLC6B-A5: LED 3mm Blue 460nm~470nm 2.7V~3.6V Through Hole Light Emitting Diodes (LED) RoHS C330760
J1 J2 = CMP-00959-3: Conn Board to Board RCP 100 POS 0.4mm Solder ST SMD T/R; Connector Type: Receptacle; Number of Positions: 100; Pitch: 0.016inch; Contact Plating: Gold; Number of Rows: 2; Package Quantity: 3000; Mount: Surface Mount; Packaging: Tape and Reel
J17 = LEDS1-4-26: 3mm LED spacer 6.4mm height
Q3 = PMBT3904,215: NPN 200mA 40V 250mW SOT-23(SOT-23-3) Transistors (NPN/PNP) RoHS
R43 R70 = 470R 0402 1% 1W: 470Ω ±1% 1/16W ±100ppm/℃ 0402 Chip Resistor - Surface Mount RoHS; Power Rating: 1W; Package: 0402; Tolerance: 1%
R71 = 10K 0402 1% 1/16W: as R79 on sheet BrauV2_TopLevel; Package: 0402; Tolerance: 1%; Power Rating: 1/16W
R90 R91 = 0R 0402 1% 1/16W: 0Ω ±1% 1/16W 0402 Chip Resistor - Surface Mount RoHS; Package: 0402; Tolerance: 1%; Power Rating: 1/16W

## Sheet BrauV2_AnalogueOutput.SchDoc
size 420 x 297 mm; PageSetup: Record=PageOptions|CenterHorizontal=True|CenterVertical=True|PrintScale=1.01|XCorrection=1.00|YCorrection=1.00|PrintKind=1|BorderSize=5000000|LeftOffset=0|BottomOffset=0|Orientation=2|PaperLength=1000|PaperWidth=1000|Scale=100|PaperSource=7|PrintQuality=-4|MediaType=1|DitherType=10|PaperKind=A3|PrintScaleMode=1; DocumentNumber: 4; SheetNumber: 4; SheetTotal: 22
Used 2 times, as channels AO1, AO2. Parts and nets are listed once, with the designators drawn on the sheet.
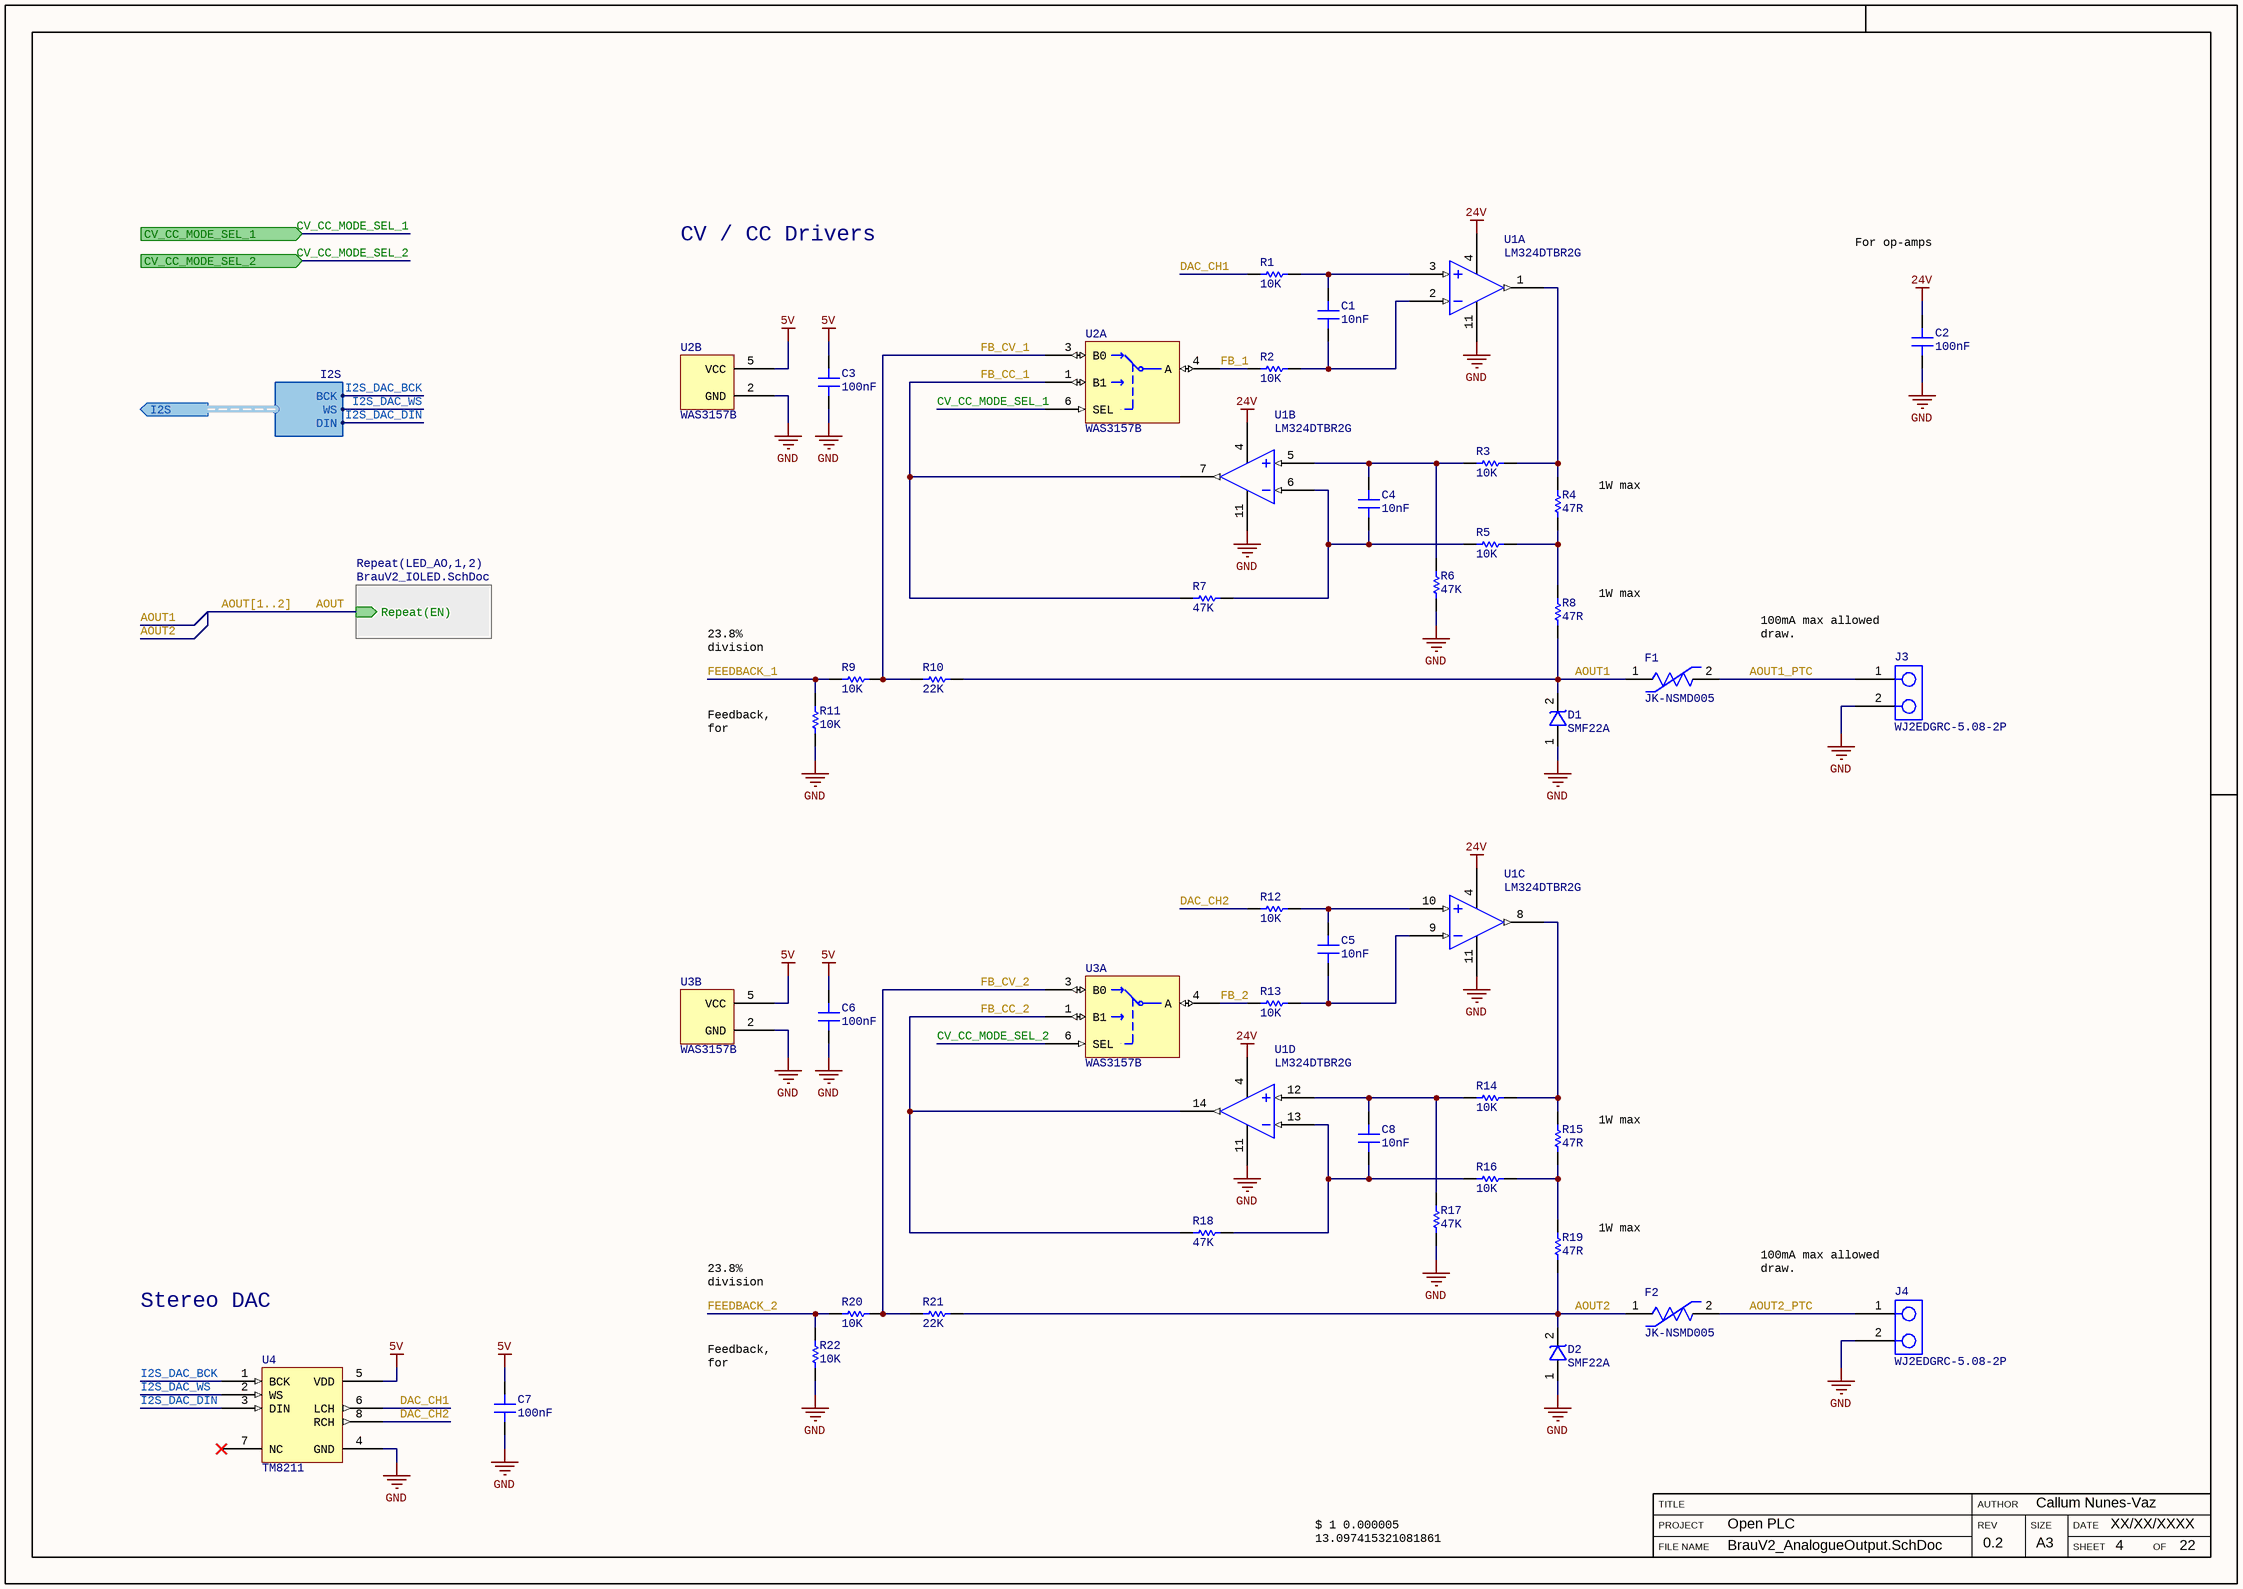
[diagram p2: BrauV2_AnalogueOutput.SchDoc]

### Parts
C1  Capacitance: 10nF  [SMD_CAP_0402(1005)_N]  (hidden comment: CC0402KRX7R9BB103)
C2  Capacitance: 100nF  [SMD_CAP_0402(1005)_N]  (hidden comment: CC0402KRX5R9BB104)
C3  Capacitance: 100nF  [SMD_CAP_0402(1005)_N]  (hidden comment: CC0402KRX5R6BB104)
C4  Capacitance: 10nF  [SMD_CAP_0402(1005)_N]  (hidden comment: CC0402KRX7R9BB103)
C5  Capacitance: 10nF  [SMD_CAP_0402(1005)_N]  (hidden comment: CC0402KRX7R9BB103)
C6  Capacitance: 100nF  [SMD_CAP_0402(1005)_N]  (hidden comment: CC0402KRX5R6BB104)
C7  Capacitance: 100nF  [SMD_CAP_0402(1005)_N]  (hidden comment: CC0402KRX5R6BB104)
C8  Capacitance: 10nF  [SMD_CAP_0402(1005)_N]  (hidden comment: CC0402KRX7R9BB103)
D1  SMF22A  [SOD-123FL]
D2  SMF22A  [SOD-123FL]
F1  JK-NSMD005  [SMD_RES_1206(3216)_N]
F2  JK-NSMD005  [SMD_RES_1206(3216)_N]
J3  WJ2EDGRC-5.08-2P  [796638-2]
J4  WJ2EDGRC-5.08-2P  [796638-2]
R1  Resistance: 10K  [SMD_RES_0402(1005)_N]  (hidden comment: RC0402FR-0710KL)
R2  Resistance: 10K  [SMD_RES_0402(1005)_N]  (hidden comment: RC0402FR-0710KL)
R3  Resistance: 10K  [SMD_RES_0402(1005)_N]  (hidden comment: RC0402FR-0710KL)
R4  Resistance: 47R  [SMD_RES_2512(6432)_N]  (hidden comment: AC2512FK-0747RL)
R5  Resistance: 10K  [SMD_RES_0402(1005)_N]  (hidden comment: RC0402FR-0710KL)
R6  Resistance: 47K  [SMD_RES_0402(1005)_N]  (hidden comment: RC0402FR-0747KL)
R7  Resistance: 47K  [SMD_RES_0402(1005)_N]  (hidden comment: RC0402FR-0747KL)
R8  Resistance: 47R  [SMD_RES_2512(6432)_N]  (hidden comment: AC2512FK-0747RL)
R9  Resistance: 10K  [SMD_RES_0402(1005)_N]  (hidden comment: RC0402FR-0710KL)
R10  Resistance: 22K  [SMD_RES_0402(1005)_N]  (hidden comment: RC0402FR-0722KL)
R11  Resistance: 10K  [SMD_RES_0402(1005)_N]  (hidden comment: RC0402FR-0710KL)
R12  Resistance: 10K  [SMD_RES_0402(1005)_N]  (hidden comment: RC0402FR-0710KL)
R13  Resistance: 10K  [SMD_RES_0402(1005)_N]  (hidden comment: RC0402FR-0710KL)
R14  Resistance: 10K  [SMD_RES_0402(1005)_N]  (hidden comment: RC0402FR-0710KL)
R15  Resistance: 47R  [SMD_RES_2512(6432)_N]  (hidden comment: AC2512FK-0747RL)
R16  Resistance: 10K  [SMD_RES_0402(1005)_N]  (hidden comment: RC0402FR-0710KL)
R17  Resistance: 47K  [SMD_RES_0402(1005)_N]  (hidden comment: RC0402FR-0747KL)
R18  Resistance: 47K  [SMD_RES_0402(1005)_N]  (hidden comment: RC0402FR-0747KL)
R19  Resistance: 47R  [SMD_RES_2512(6432)_N]  (hidden comment: AC2512FK-0747RL)
R20  Resistance: 10K  [SMD_RES_0402(1005)_N]  (hidden comment: RC0402FR-0710KL)
R21  Resistance: 22K  [SMD_RES_0402(1005)_N]  (hidden comment: RC0402FR-0722KL)
R22  Resistance: 10K  [SMD_RES_0402(1005)_N]  (hidden comment: RC0402FR-0710KL)
U1  LM324DTBR2G  [TSSOP-14]  (parts A,B,C,D of 4)
U2  WAS3157B  [SOT23-6]  (parts A,B of 2)
U3  WAS3157B  [SOT23-6]  (parts A,B of 2)
U4  TM8211  [SOIC-8-3.9mm]

### Sub-sheets
Repeat(LED_AO,1,2) = BrauV2_IOLED.SchDoc (file not in this document): Repeat(EN) (in)

### Ports
CV_CC_MODE_SEL_1 (in), CV_CC_MODE_SEL_2 (in), I2S (out, harness I2S)

### Harnesses
I2S: WS, BCK, DIN

### Nets
5V: C3.2 C6.2 C7.2 U2.5(VCC) U3.5(VCC) U4.5(VDD)
24V: C2.2 U1.4(VDD)
GND: C2.1 C3.1 C6.1 C7.1 D1.1(ANODE) D2.1(ANODE) J3.2 J4.2 R6.1 R11.1 R17.1 R22.1 U1.11(VSS) U2.2(GND) U3.2(GND) U4.4(GND)
AOUT: sheet Repeat(LED_AO,1,2)/Repeat(EN)
AOUT1: D1.2(CATHODE) F1.1 R8.1 R10.2
AOUT1_PTC: F1.2 J3.1
AOUT2: D2.2(CATHODE) F2.1 R19.1 R21.2
AOUT2_PTC: F2.2 J4.1
CV_CC_MODE_SEL_1: U2.6(SEL) ; port CV_CC_MODE_SEL_1
CV_CC_MODE_SEL_2: U3.6(SEL) ; port CV_CC_MODE_SEL_2
DAC_CH1: R1.1 U4.6(LCH)
DAC_CH2: R12.1 U4.8(RCH)
FB_1: R2.1 U2.4(A)
FB_2: R13.1 U3.4(A)
FB_CC_1: R7.1 U1.7(VOUT) U2.1(B1)
FB_CC_2: R18.1 U1.14(VOUT) U3.1(B1)
FB_CV_1: R9.1 R10.1 U2.3(B0)
FB_CV_2: R20.1 R21.1 U3.3(B0)
FEEDBACK_1: R9.2 R11.2
FEEDBACK_2: R20.2 R22.2
I2S_DAC_BCK: U4.1(BCK) ; port I2S.BCK
I2S_DAC_DIN: U4.3(DIN) ; port I2S.DIN
I2S_DAC_WS: U4.2(WS) ; port I2S.WS
NetC1_1: C1.1 R2.2 U1.2(VIN-)
NetC1_2: C1.2 R1.2 U1.3(VIN+)
NetC4_1: C4.1 R5.1 R7.2 U1.6(VIN-)
NetC4_2: C4.2 R3.1 R6.2 U1.5(VIN+)
NetC5_1: C5.1 R13.2 U1.9(VIN-)
NetC5_2: C5.2 R12.2 U1.10(VIN+)
NetC8_1: C8.1 R16.1 R18.2 U1.13(VIN-)
NetC8_2: C8.2 R14.1 R17.2 U1.12(VIN+)
NetR3_2: R3.2 R4.2 U1.1(VOUT)
NetR4_1: R4.1 R5.2 R8.2
NetR14_2: R14.2 R15.2 U1.8(VOUT)
NetR15_1: R15.1 R16.2 R19.2

Not connected (* = marked no-connect by the designer): U4 7(NC)*

### Channels
AO1: designators end in _1; ports CV_CC_MODE_SEL_1=CV_CC_MODE_SEL_1 CV_CC_MODE_SEL_2=CV_CC_MODE_SEL_2
AO2: designators end in _2; ports CV_CC_MODE_SEL_1=CV_CC_MODE_SEL_1 CV_CC_MODE_SEL_2=CV_CC_MODE_SEL_2

### Buses and harness runs
bus AOUT[1..2]

### Notes on the sheet
- CV / CC Drivers
- For op-amps
- (near R4) 1W max
- 23.8% division
  10V -> 2.38V
- (near R8) 1W max
- (near J3) 100mA max allowed draw.
- (near R11) Feedback, for calibration.
- (near R15) 1W max
- (near R19) 1W max
- (near J4) 100mA max allowed draw.
- Stereo DAC
- (near R22) Feedback, for calibration.
- $ 1 0.000005 13.097415321081861 59 5 43
  a 112 368 224 368 9 24 0 1000000 3.4499099223934393 3.45 100000
  a 240 544 128 544 9 24 0 1000000 7.427410265066887 7.427451769031732 100000
  r 112 384 -80 384 0 10000
  w 112 352 -144 352 0
  R -144 352 -144 304 0 0 40 3.45 0 0 0.5
  w -80 544 128 544 0
  w 128 544 128 624 0
  r 128 624 256 624 0 47000
  w 256 624 256 592 0
  w 240 528 288 528 0
  w 240 560 256 560 0
  w 256 560 256 592 0
  w 256 592 320 592 0
  w 288 528 320 528 0
  r 320 528 464 528 0 10000
  r 320 592 464 592 0 10000
  r 464 592 464 528 0 47
  r 464 592 464 736 0 47
  w -128 384 -80 384 0
  w 224 368 464 368 0
  w 464 368 464 528 0
  368 464 736 528 736 0 0
  r 464 848 464 944 0 390.61
  g 464 944 464 960 0 0
  w 464 736 -32 736 0
  w 288 528 288 608 0
  r 288 608 288 672 0 47000
  g 288 672 288 688 0 0
  r -80 544 -80 448 0 560
  370 464 736 464 848 1 0 0
  s -80 384 -80 448 0 1 false
  s -128 384 -128 448 0 0 false
  368 -128 384 -192 384 0 0
  r -128 864 -128 928 0 10000
  g -128 928 -128 960 0 0
  r -128 736 -128 864 0 10000
  368 -80 544 -80 592 0 0
  r -128 448 -128 544 0 560
  w -128 544 -128 736 0
  368 464 368 528 368 0 0
  368 -128 864 -192 864 0 0
  r -32 736 -128 736 0 22000
  o 24 64 0 4099 40 0.0015625 0 2 24 3
  38 4 0 0 5 Voltage
  38 22 0 1 1000 Resistance
- FILE NAME
- PROJECT
- TITLE
- REV
- AUTHOR
- SIZE
- SHEET
- DATE
- OF
- A3

### Library data of the parts
C1 C4 C5 C8 = 10nF 0402 50V 10%: 10nF ±10% 50V X7R 0402 Multilayer Ceramic Capacitors MLCC - SMD/SMT RoHS; Package: 0402; Tolerance: 10%; Voltage Rating: 50V
C2 = 100nF 0402 50V 10%: 100nF ±10% 50V X5R 0402 Multilayer Ceramic Capacitors MLCC - SMD/SMT RoHS; Package: 0402; Tolerance: 10%; Voltage Rating: 50V
C3 C6 C7 = 100nF 0402 10V 10%: 100nF ±10% 10V X5R 0402 Multilayer Ceramic Capacitors MLCC - SMD/SMT RoHS; Package: 0402; Tolerance: 10%; Voltage Rating: 10V
D1 D2 = SMF22A: Unidirectional 22V 24.4V 35.5V 5.6A SOD-123F TVS RoHS
F1 F2 = JK-NSMD005: 60V 150mA 1.5s 1206 PTC Resettable Fuses RoHS
J3 J4 = WJ2EDGRC-5.08-2P: Covered（4Sided） 2 1 0.200"（5.08mm） 2 P=5.08mm Pluggable System Terminal Block RoHS
R1-R3 R5 R9 R11-R14 R16 R20 R22 = 10K 0402 1% 1/16W: as R79 on sheet BrauV2_TopLevel; Package: 0402; Tolerance: 1%; Power Rating: 1/16W
R4 R8 R15 R19 = 47R 2512 1% 1W: 47Ω ±1% 1W ±100ppm/℃ 2512 Chip Resistor - Surface Mount RoHS; Package: 2512; Tolerance: 1%; Power Rating: 1W
R6 R7 R17 R18 = 47K 0402 1% 1/16W: 47kΩ ±1% 1/16W ±100ppm/℃ 0402 Chip Resistor - Surface Mount RoHS; Package: 0402; Tolerance: 1%; Power Rating: 1/16W
R10 R21 = 22K 0402 1% 1/16W: 22kΩ ±1% 1/16W ±100ppm/℃ 0402 Chip Resistor - Surface Mount RoHS; Package: 0402; Tolerance: 1%; Power Rating: 1/16W
U1 = LM324DTBR2G: General Purpose 4 3V ~ 32V, ±1.5V ~ 16V 1MHz 0.6 V/us TSSOP-14 Operational Amplifiers RoHS
U2 U3 = WAS3157B: 5.5Ω, 400MHz Bandwidth, SPDT Analog Switch SOT23-6
U4 = TM8211: Digital To Analog Converters (DACs) 16bit I2S

## Sheet BrauV2_IOController.SchDoc
size 420 x 297 mm; DocumentNumber: 12; SheetNumber: 12; SheetTotal: 22
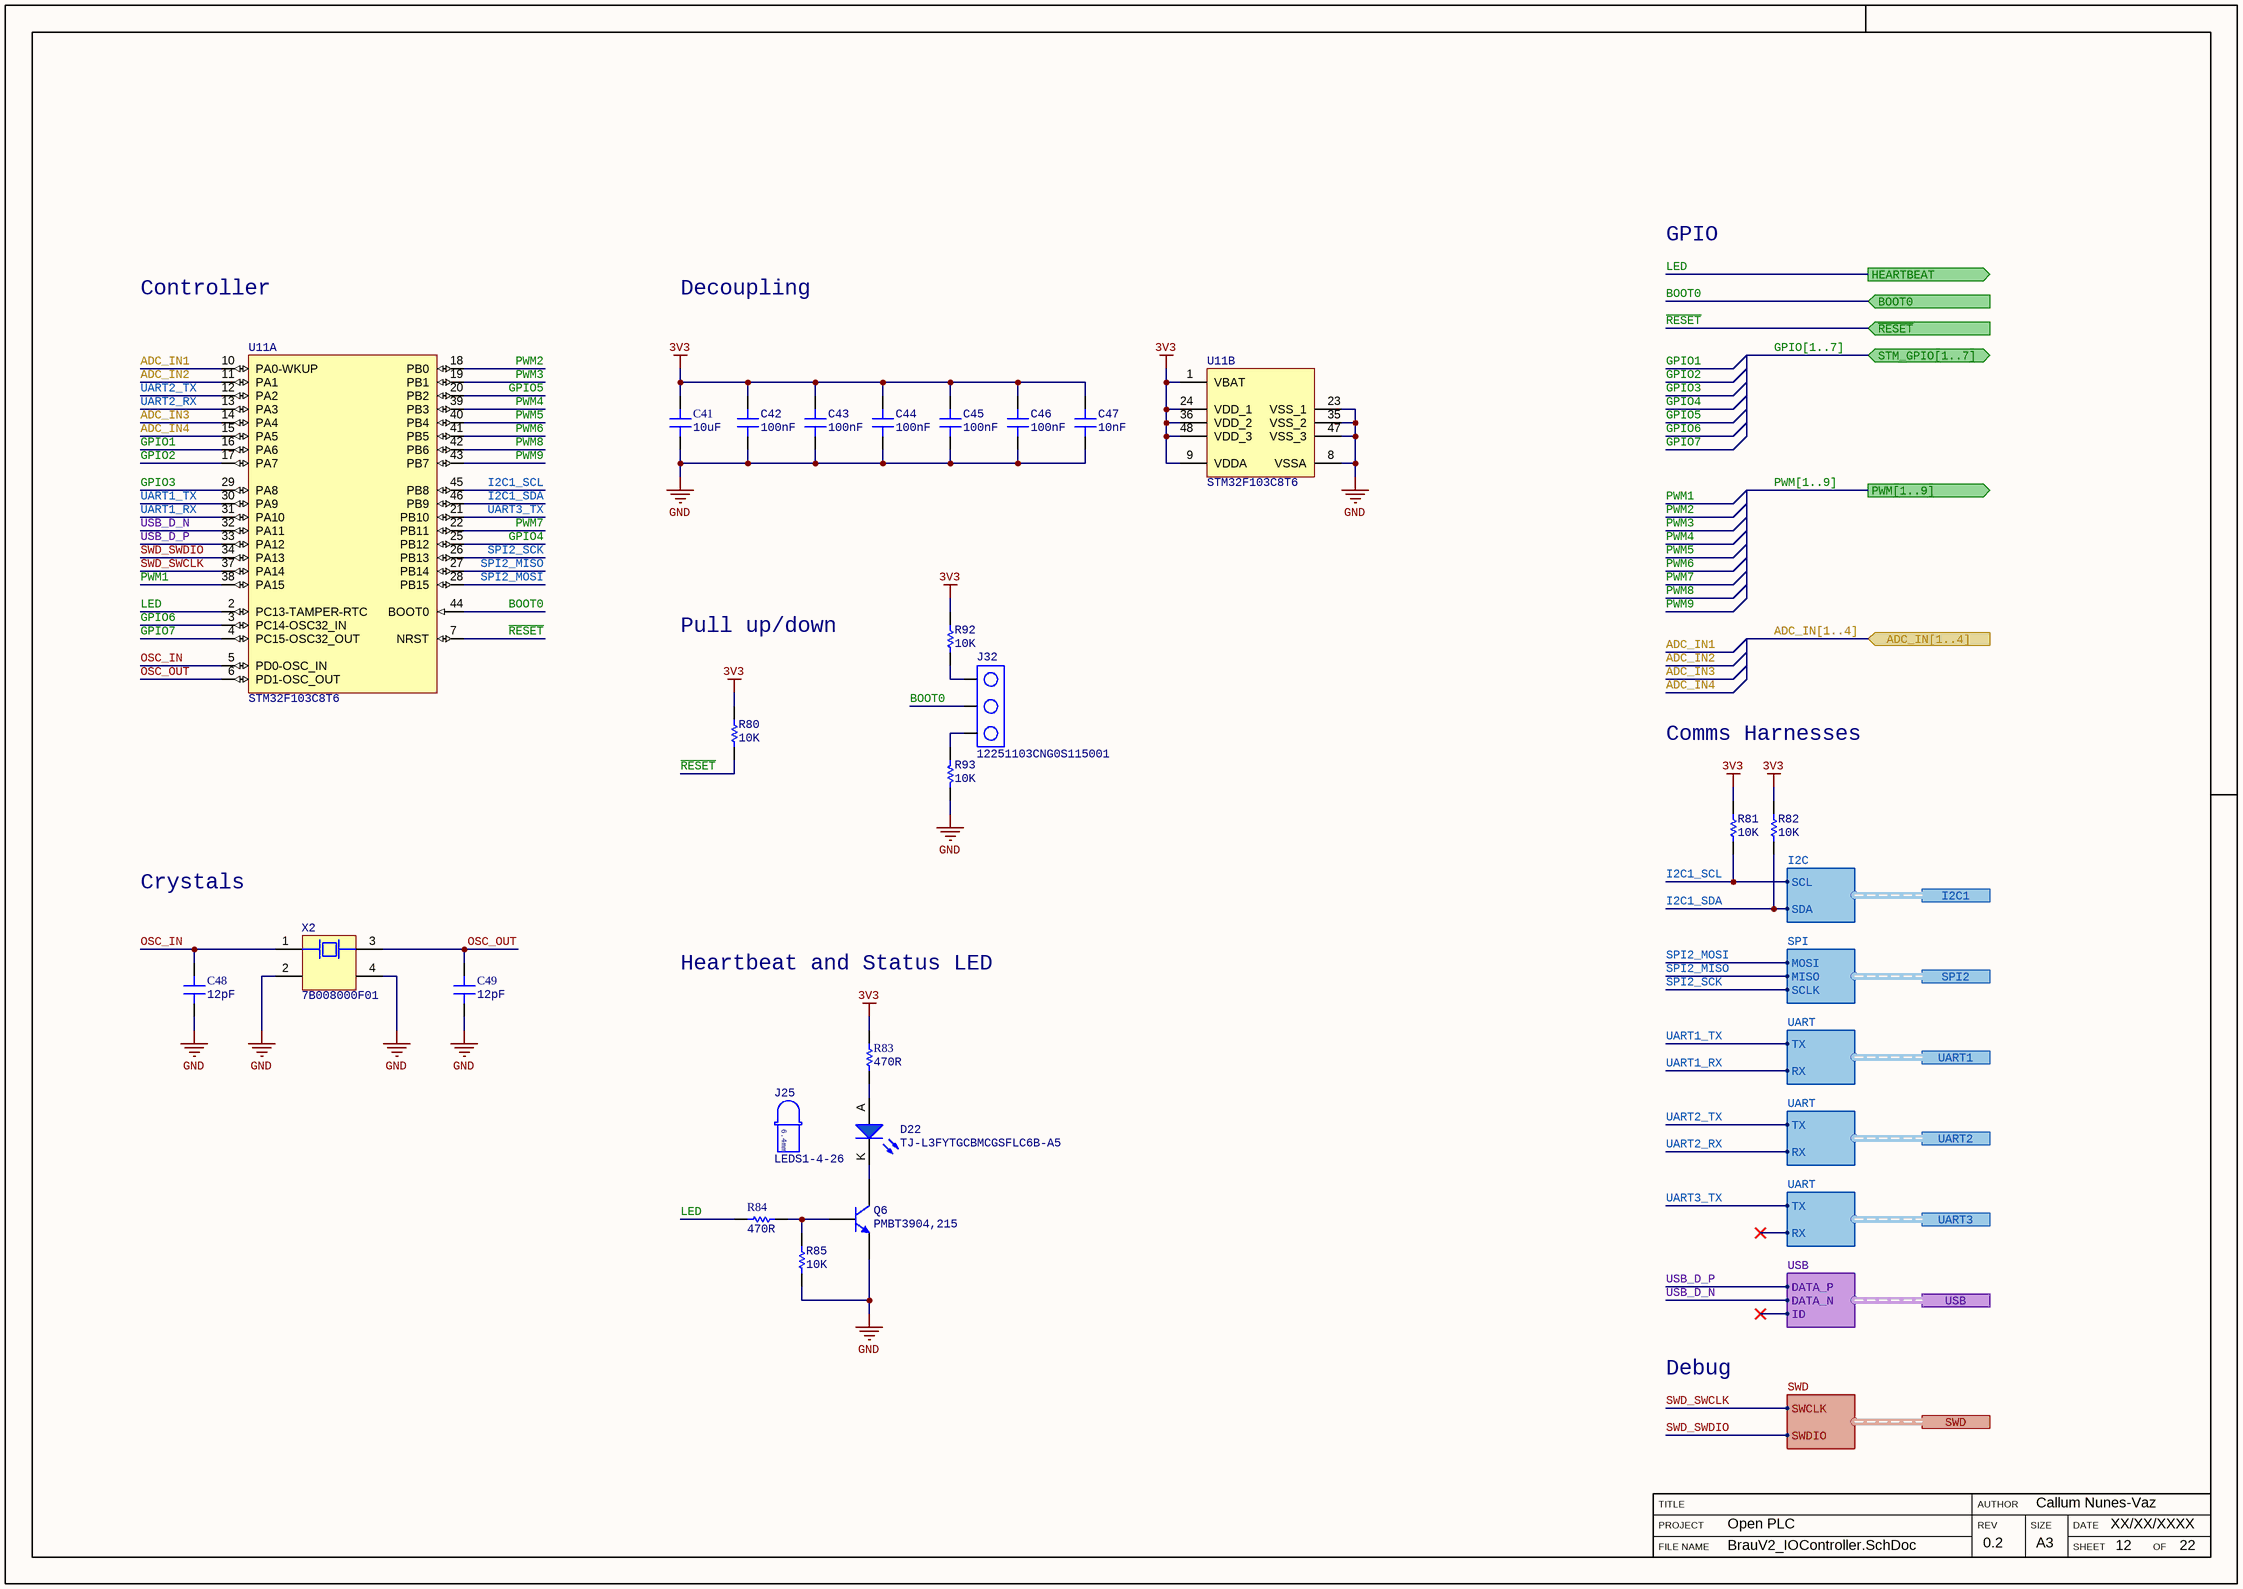
[diagram p3: BrauV2_IOController.SchDoc]

### Parts
C41  Capacitance: 10uF  [SMD_CAP_1206(3216)_N]  (hidden comment: CC1206KKX5R9BB106)
C42  Capacitance: 100nF  [SMD_CAP_0402(1005)_N]  (hidden comment: CC0402KRX5R6BB104)
C43  Capacitance: 100nF  [SMD_CAP_0402(1005)_N]  (hidden comment: CC0402KRX5R6BB104)
C44  Capacitance: 100nF  [SMD_CAP_0402(1005)_N]  (hidden comment: CC0402KRX5R6BB104)
C45  Capacitance: 100nF  [SMD_CAP_0402(1005)_N]  (hidden comment: CC0402KRX5R6BB104)
C46  Capacitance: 100nF  [SMD_CAP_0402(1005)_N]  (hidden comment: CC0402KRX5R6BB104)
C47  Capacitance: 10nF  [SMD_CAP_0402(1005)_N]  (hidden comment: CC0402KRX7R9BB103)
C48  Capacitance: 12pF  [SMD_CAP_0402(1005)_N]  (hidden comment: CC0402JRNPO9BN120)
C49  Capacitance: 12pF  [SMD_CAP_0402(1005)_N]  (hidden comment: CC0402JRNPO9BN120)
D22  TJ-L3FYTGCBMCGSFLC6B-A5  [LED_3MM_SPACED_6.4MM_BLUE]
J25  LEDS1-4-26  [3MM_LED_SPACER_6.4MM]
J32  12251103CNG0S115001  [Header_3POS]
Q6  PMBT3904,215  [SOT23-3]
R80  Resistance: 10K  [SMD_RES_0402(1005)_N]  (hidden comment: RC0402FR-0710KL)
R81  Resistance: 10K  [SMD_RES_0402(1005)_N]  (hidden comment: RC0402FR-0710KL)
R82  Resistance: 10K  [SMD_RES_0402(1005)_N]  (hidden comment: RC0402FR-0710KL)
R83  Resistance: 470R  [SMD_RES_0402(1005)_N]  (hidden comment: RC0402FR-07470RL)
R84  Resistance: 470R  [SMD_RES_0402(1005)_N]  (hidden comment: RC0402FR-07470RL)
R85  Resistance: 10K  [SMD_RES_0402(1005)_N]  (hidden comment: RC0402FR-0710KL)
R92  Resistance: 10K  [SMD_RES_0402(1005)_N]  (hidden comment: RC0402FR-0710KL)
R93  Resistance: 10K  [SMD_RES_0402(1005)_N]  (hidden comment: RC0402FR-0710KL)
U11  STM32F103C8T6  [LQFP32_7x7]  (parts A,B of 2)
X2  7B008000F01  [CRYSTAL_3225]

### Ports
ADC_IN[1..4] (in), BOOT0 (in), HEARTBEAT (out), I2C1 (harness I2C), PWM[1..9] (out), SPI2 (harness SPI), STM_GPIO[1..7] (bidir), SWD (harness SWD), UART1 (harness UART), UART2 (harness UART), UART3 (harness UART), USB (harness USB), ~{RESET} (in)

### Harnesses
I2C: SCL, SDA
SWD: SWCLK, SWDIO
UART: TX, RX
SPI: MOSI, MISO, SCLK
USB: DATA_P, DATA_N, ID

### Nets
3V3: C41.2 C42.2 C43.2 C44.2 C45.2 C46.2 C47.2 R80.2 R81.2 R82.2 R83.1 R92.2 U11.1(VBAT) U11.9(VDDA) U11.24(VDD_1) U11.36(VDD_2) U11.48(VDD_3)
GND: C41.1 C42.1 C43.1 C44.1 C45.1 C46.1 C47.1 C48.1 C49.1 Q6.2(E) R85.1 R93.2 U11.8(VSSA) U11.23(VSS_1) U11.35(VSS_2) U11.47(VSS_3) X2.2 X2.4
ADC_IN1: U11.10(PA0-WKUP)
ADC_IN2: U11.11(PA1)
ADC_IN3: U11.14(PA4)
ADC_IN4: U11.15(PA5)
BOOT0: J32.2 U11.44(BOOT0) ; port BOOT0
GPIO1: U11.16(PA6)
GPIO2: U11.17(PA7)
GPIO3: U11.29(PA8)
GPIO4: U11.25(PB12)
GPIO5: U11.20(PB2)
GPIO6: U11.3(PC14-OSC32_IN)
GPIO7: U11.4(PC15-OSC32_OUT)
I2C1_SCL: R81.1 U11.45(PB8) ; port I2C1.SCL  [project net I2C.SCL]
I2C1_SDA: R82.1 U11.46(PB9) ; port I2C1.SDA  [project net I2C.SDA]
LED: R84.2 U11.2(PC13-TAMPER-RTC) ; port HEARTBEAT
OSC_IN: C48.2 U11.5(PD0-OSC_IN) X2.1
OSC_OUT: C49.2 U11.6(PD1-OSC_OUT) X2.3
PWM1: U11.38(PA15)
PWM2: U11.18(PB0)
PWM3: U11.19(PB1)
PWM4: U11.39(PB3)
PWM5: U11.40(PB4)
PWM6: U11.41(PB5)
PWM7: U11.22(PB11)
PWM8: U11.42(PB6)
PWM9: U11.43(PB7)
~{RESET}: R80.1 U11.7(NRST) ; port ~{RESET}
SPI2_MISO: U11.27(PB14) ; port SPI2.MISO
SPI2_MOSI: U11.28(PB15) ; port SPI2.MOSI
SPI2_SCK: U11.26(PB13) ; port SPI2.SCLK
SWD_SWCLK: U11.37(PA14) ; port SWD.SWCLK  [project net GPIO7]
SWD_SWDIO: U11.34(PA13) ; port SWD.SWDIO  [project net GPIO10]
UART1_RX: U11.31(PA10) ; port UART1.RX  [project net GPIO5]
UART1_TX: U11.30(PA9) ; port UART1.TX  [project net GPIO4]
UART2_RX: U11.13(PA3) ; port UART2.RX  [project net STM_UART2.RX]
UART2_TX: U11.12(PA2) ; port UART2.TX  [project net STM_UART2.TX]
UART3_TX: U11.21(PB10) ; port UART3.TX  [project net STM_UART3.TX]
USB_D_N: U11.32(PA11) ; port USB.DATA_N  [project net STM_USB_MCU.DATA_N]
USB_D_P: U11.33(PA12) ; port USB.DATA_P  [project net STM_USB_MCU.DATA_P]
NetD22_A: D22.A R83.2
NetD22_K: D22.K Q6.3(C)
NetJ32_1: J32.1 R92.1
NetJ32_3: J32.3 R93.1
NetQ6_1: Q6.1(B) R84.1 R85.2

### Buses and harness runs
bus ADC_IN[1..4] = port ADC_IN[1..4]
bus GPIO[1..7] = port STM_GPIO[1..7]
bus PWM[1..9] = port PWM[1..9]

### Notes on the sheet
- GPIO
- Controller
- Decoupling
- Pull up/down
- Comms Harnesses
- Crystals
- Heartbeat and Status LED
- Debug
- FILE NAME
- PROJECT
- TITLE
- REV
- AUTHOR
- SIZE
- SHEET
- DATE
- OF
- A3
- (in symbol LEDS1-4-26) 6.4mm

### Library data of the parts
C41 = 10uF 1206 50V 10%: 10uF ±10% 50V X5R 1206 Multilayer Ceramic Capacitors MLCC - SMD/SMT RoHS; Package: 1206; Tolerance: 10%; Voltage Rating: 50V
C42-C46 = 100nF 0402 10V 10%: as C3 on sheet BrauV2_AnalogueOutput; Package: 0402; Tolerance: 10%; Voltage Rating: 10V
C47 = 10nF 0402 50V 10%: as C1 on sheet BrauV2_AnalogueOutput; Package: 0402; Tolerance: 10%; Voltage Rating: 50V
C48 C49 = 12pF 0402 50V 5%: 12pF ±5% 50V NP0 0402 Multilayer Ceramic Capacitors MLCC - SMD/SMT RoHS; Package: 0402; Tolerance: 5%; Voltage Rating: 50V
D22 = TJ-L3FYTGCBMCGSFLC6B-A5: as D7 on sheet BrauV2_ComputeModule
J25 = LEDS1-4-26: 3mm LED spacer 6.4mm height
J32 = 3-way Jumper: as J11 on sheet BrauV2_TopLevel
Q6 = PMBT3904,215: as Q3 on sheet BrauV2_ComputeModule
R80-R82 R85 R92 R93 = 10K 0402 1% 1/16W: as R79 on sheet BrauV2_TopLevel; Package: 0402; Tolerance: 1%; Power Rating: 1/16W
R83 R84 = 470R 0402 1% 1W: as R43 on sheet BrauV2_ComputeModule; Package: 0402; Tolerance: 1%
U11 = STM32F103C8T6: Mainstream Performance line, Arm Cortex-M3 MCU with 64 Kbytes of Flash memory, 72 MHz CPU, motor control, USB and CAN
X2 = 7B008000F01: 8MHz ±10ppm 8pF 200Ω SMD-3225_4P SMD Crystal Resonators RoHS

## Sheet BrauV2_USBSwitch.SchDoc
size 420 x 297 mm; PageSetup: Record=PageOptions|CenterHorizontal=True|CenterVertical=True|PrintScale=1.01|XCorrection=1.00|YCorrection=1.00|PrintKind=1|BorderSize=5000000|LeftOffset=0|BottomOffset=0|Orientation=2|PaperLength=1000|PaperWidth=1000|Scale=100|PaperSource=7|PrintQuality=-4|MediaType=1|DitherType=10|PaperKind=A3|PrintScaleMode=1; DocumentNumber: 15; SheetNumber: 15; SheetTotal: 22
Used 2 times, as channels USBMUX1, USBMUX2. Parts and nets are listed once, with the designators drawn on the sheet.
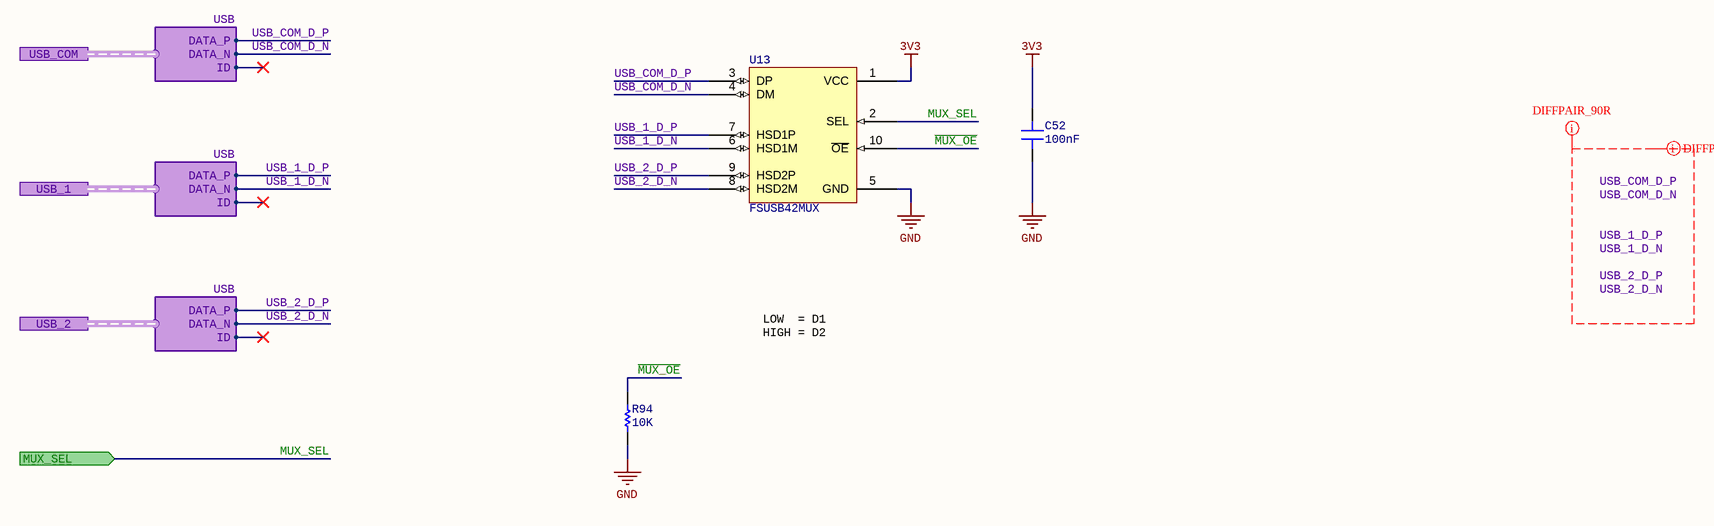
[diagram p4: BrauV2_USBSwitch.SchDoc]

### Parts
C52  Capacitance: 100nF  [SMD_CAP_0402(1005)_N]  (hidden comment: CC0402KRX5R6BB104)
R94  Resistance: 10K  [SMD_RES_0402(1005)_N]  (hidden comment: RC0402FR-0710KL)
U13  FSUSB42MUX  [MSOP-10]

### Ports
MUX_SEL (in), USB_1 (harness USB), USB_2 (harness USB), USB_COM (harness USB)

### Harnesses
USB: DATA_P, DATA_N, ID

### Nets
3V3: C52.2 U13.1(VCC)
GND: C52.1 R94.1 U13.5(GND)
~{MUX_OE}: R94.2 U13.10(~{OE})
MUX_SEL: U13.2(SEL) ; port MUX_SEL
USB_1_D_N: U13.6(HSD1M) ; port USB_1.DATA_N
USB_1_D_P: U13.7(HSD1P) ; port USB_1.DATA_P
USB_2_D_N: U13.8(HSD2M) ; port USB_2.DATA_N
USB_2_D_P: U13.9(HSD2P) ; port USB_2.DATA_P
USB_COM_D_N: U13.4(DM) ; port USB_COM.DATA_N
USB_COM_D_P: U13.3(DP) ; port USB_COM.DATA_P

### Channels
USBMUX1: designators end in _1; ports MUX_SEL=MUX_SEL
USBMUX2: designators end in _2; ports MUX_SEL=MUX_SEL

### Layout directives
differential pair; differential pair class 90R_DIFF_PAIRS; net class 90R_PAIRS: USB_1_D_N, USB_1_D_P, USB_2_D_N, USB_2_D_P, USB_COM_D_N, USB_COM_D_P
mark named DIFFPAIR_90R: USB_1_D_N, USB_1_D_P, USB_2_D_N, USB_2_D_P, USB_COM_D_N, USB_COM_D_P

### Notes on the sheet
- LOW  = D1
  HIGH = D2
- Labels drawn without touching a wire or pin: USB_1_D_N, USB_1_D_P, USB_2_D_N, USB_2_D_P, USB_COM_D_N, USB_COM_D_P
- FILE NAME
- PROJECT
- TITLE
- REV
- AUTHOR
- SIZE
- SHEET
- DATE
- OF
- A3

### Library data of the parts
C52 = 100nF 0402 10V 10%: as C3 on sheet BrauV2_AnalogueOutput; Package: 0402; Tolerance: 10%; Voltage Rating: 10V
R94 = 10K 0402 1% 1/16W: as R79 on sheet BrauV2_TopLevel; Package: 0402; Tolerance: 1%; Power Rating: 1/16W
U13 = FSUSB42MUX: MSOP-10 USB ICs RoHS

## Sheet BrauV2_Buzzer.SchDoc
size 420 x 297 mm; PageSetup: Record=PageOptions|CenterHorizontal=True|CenterVertical=True|PrintScale=1.01|XCorrection=1.00|YCorrection=1.00|PrintKind=1|BorderSize=5000000|LeftOffset=0|BottomOffset=0|Orientation=2|PaperLength=1000|PaperWidth=1000|Scale=100|PaperSource=7|PrintQuality=-4|MediaType=1|DitherType=10|PaperKind=A3|PrintScaleMode=1; DocumentNumber: 18; SheetNumber: 18; SheetTotal: 22
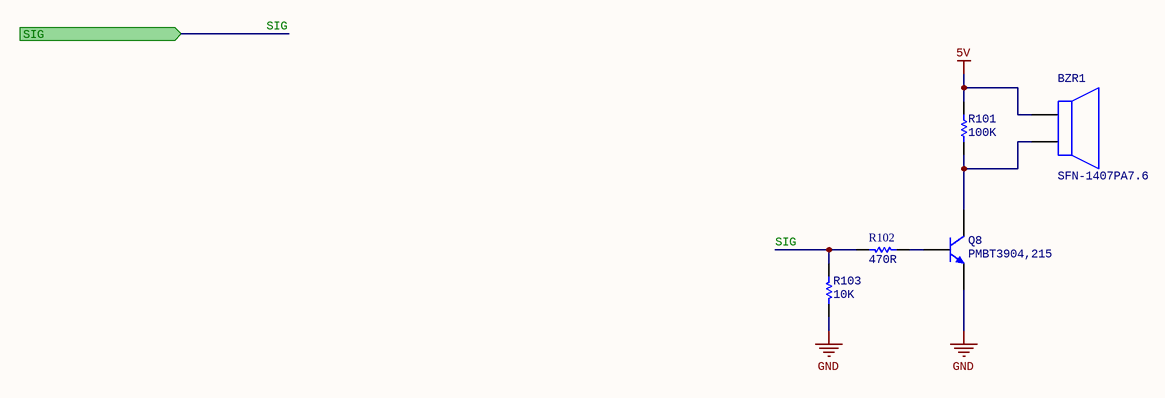
[diagram p5: BrauV2_Buzzer.SchDoc]

### Parts
BZR1  SFN-1407PA7.6  [SFN-1407PA7.6]
Q8  PMBT3904,215  [SOT23-3]
R101  Resistance: 100K  [SMD_RES_0402(1005)_N]  (hidden comment: RC0402FR-07100KL)
R102  Resistance: 470R  [SMD_RES_0402(1005)_N]  (hidden comment: RC0402FR-07470RL)
R103  Resistance: 10K  [SMD_RES_0402(1005)_N]  (hidden comment: RC0402FR-0710KL)

### Ports
SIG (in)

### Nets
5V: BZR1.1 R101.2
GND: Q8.2(E) R103.1
SIG: R102.1 R103.2 ; port SIG  [project net PWM9]
NetBZR1_2: BZR1.2 Q8.3(C) R101.1
NetQ8_1: Q8.1(B) R102.2

### Notes on the sheet
- FILE NAME
- PROJECT
- TITLE
- REV
- AUTHOR
- SIZE
- SHEET
- DATE
- OF
- A3

### Library data of the parts
BZR1 = SFN-1407PA7.6: Piezo YES 3300±500Hz 85dB @ 24V, 10cm 24V Φ23.5mm Through Hole Buzzers RoHS
Q8 = PMBT3904,215: as Q3 on sheet BrauV2_ComputeModule
R101 = 100K 0402 1% 1/16W: 100kΩ ±1% 1/16W ±100ppm/℃ 0402 Chip Resistor - Surface Mount RoHS; Package: 0402; Tolerance: 1%; Power Rating: 1/16W
R102 = 470R 0402 1% 1W: as R43 on sheet BrauV2_ComputeModule; Package: 0402; Tolerance: 1%
R103 = 10K 0402 1% 1/16W: as R79 on sheet BrauV2_TopLevel; Package: 0402; Tolerance: 1%; Power Rating: 1/16W

## Sheet BrauV2_AnalogueInput.SchDoc
size 420 x 297 mm; PageSetup: Record=PageOptions|CenterHorizontal=True|CenterVertical=True|PrintScale=1.01|XCorrection=1.00|YCorrection=1.00|PrintKind=1|BorderSize=5000000|LeftOffset=0|BottomOffset=0|Orientation=2|PaperLength=1000|PaperWidth=1000|Scale=100|PaperSource=7|PrintQuality=-4|MediaType=1|DitherType=10|PaperKind=A3|PrintScaleMode=1; DocumentNumber: 5; SheetNumber: 5; SheetTotal: 22
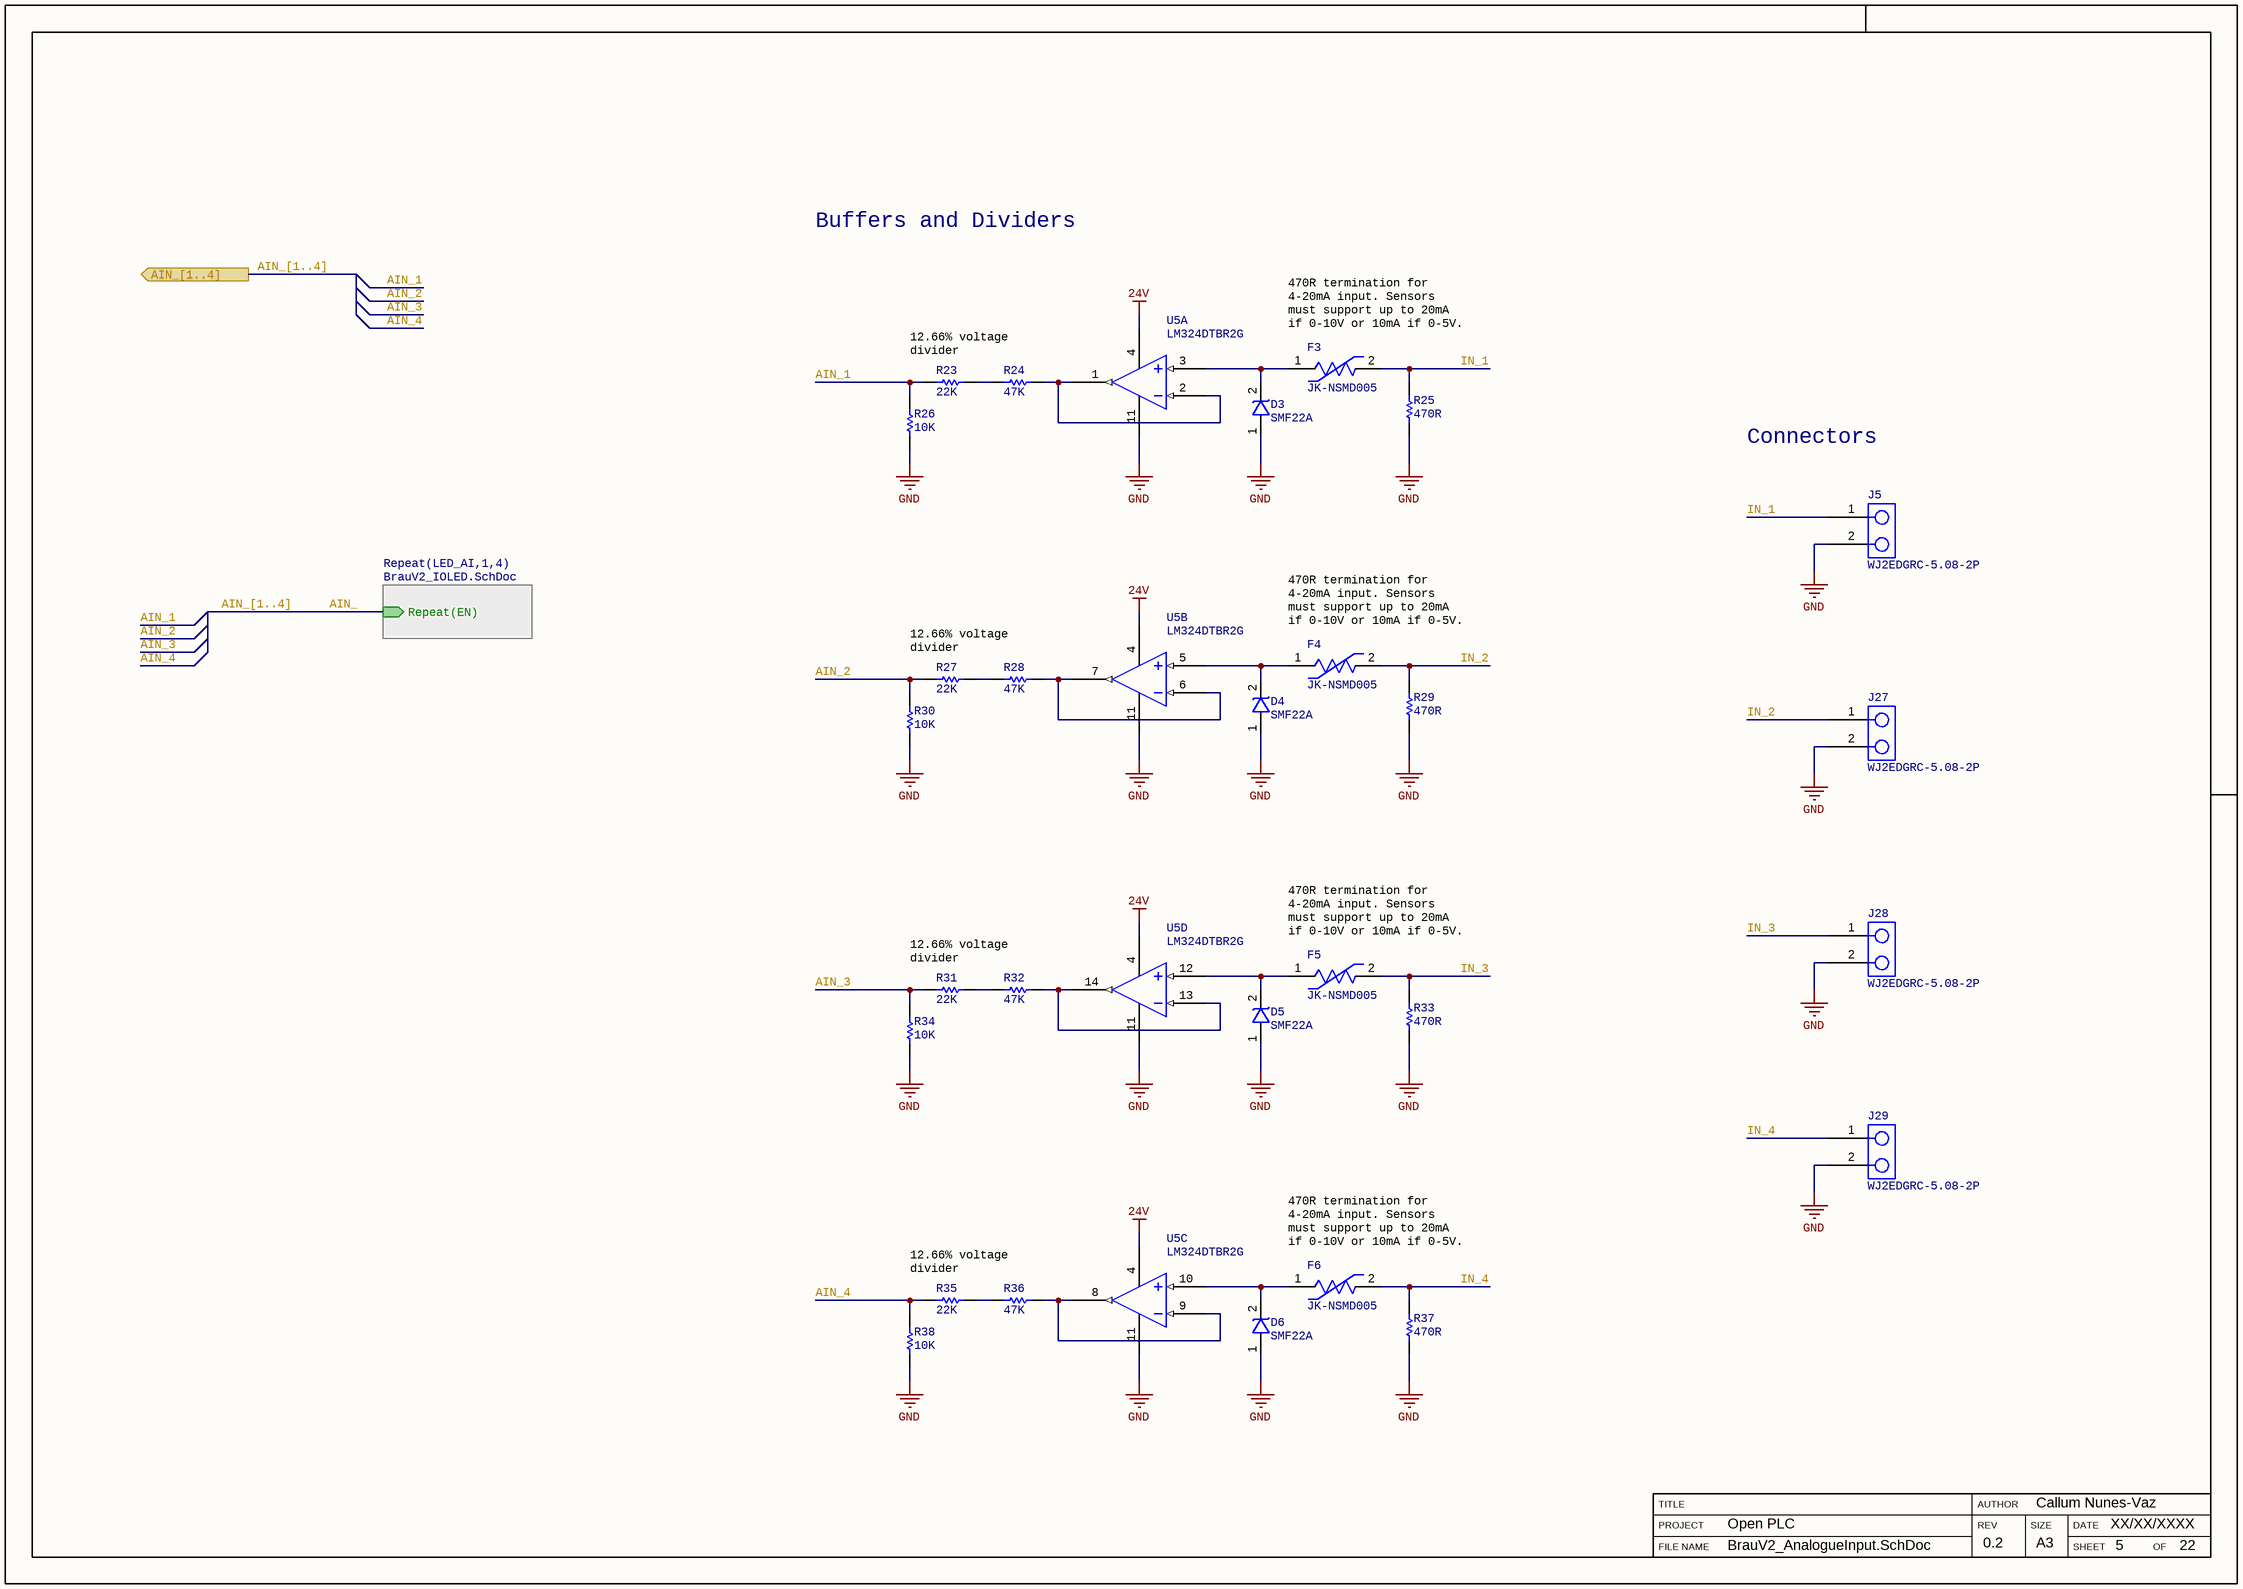
[diagram p6: BrauV2_AnalogueInput.SchDoc]

### Parts
D3  SMF22A  [SOD-123FL]
D4  SMF22A  [SOD-123FL]
D5  SMF22A  [SOD-123FL]
D6  SMF22A  [SOD-123FL]
F3  JK-NSMD005  [SMD_RES_1206(3216)_N]
F4  JK-NSMD005  [SMD_RES_1206(3216)_N]
F5  JK-NSMD005  [SMD_RES_1206(3216)_N]
F6  JK-NSMD005  [SMD_RES_1206(3216)_N]
J5  WJ2EDGRC-5.08-2P  [796638-2]
J27  WJ2EDGRC-5.08-2P  [796638-2]
J28  WJ2EDGRC-5.08-2P  [796638-2]
J29  WJ2EDGRC-5.08-2P  [796638-2]
R23  Resistance: 22K  [SMD_RES_0402(1005)_N]  (hidden comment: RC0402FR-0722KL)
R24  Resistance: 47K  [SMD_RES_0402(1005)_N]  (hidden comment: RC0402FR-0747KL)
R25  Resistance: 470R  [SMD_RES_2512(6432)_N]  (hidden comment: AC2512FK-07470RL)
R26  Resistance: 10K  [SMD_RES_0402(1005)_N]  (hidden comment: RC0402FR-0710KL)
R27  Resistance: 22K  [SMD_RES_0402(1005)_N]  (hidden comment: RC0402FR-0722KL)
R28  Resistance: 47K  [SMD_RES_0402(1005)_N]  (hidden comment: RC0402FR-0747KL)
R29  Resistance: 470R  [SMD_RES_2512(6432)_N]  (hidden comment: AC2512FK-07470RL)
R30  Resistance: 10K  [SMD_RES_0402(1005)_N]  (hidden comment: RC0402FR-0710KL)
R31  Resistance: 22K  [SMD_RES_0402(1005)_N]  (hidden comment: RC0402FR-0722KL)
R32  Resistance: 47K  [SMD_RES_0402(1005)_N]  (hidden comment: RC0402FR-0747KL)
R33  Resistance: 470R  [SMD_RES_2512(6432)_N]  (hidden comment: AC2512FK-07470RL)
R34  Resistance: 10K  [SMD_RES_0402(1005)_N]  (hidden comment: RC0402FR-0710KL)
R35  Resistance: 22K  [SMD_RES_0402(1005)_N]  (hidden comment: RC0402FR-0722KL)
R36  Resistance: 47K  [SMD_RES_0402(1005)_N]  (hidden comment: RC0402FR-0747KL)
R37  Resistance: 470R  [SMD_RES_2512(6432)_N]  (hidden comment: AC2512FK-07470RL)
R38  Resistance: 10K  [SMD_RES_0402(1005)_N]  (hidden comment: RC0402FR-0710KL)
U5  LM324DTBR2G  [TSSOP-14]  (parts A,B,C,D of 4)

### Sub-sheets
Repeat(LED_AI,1,4) = BrauV2_IOLED.SchDoc (file not in this document): Repeat(EN) (in)

### Ports
AIN_[1..4] (out)

### Nets
24V: U5.4(VDD)
GND: D3.1(ANODE) D4.1(ANODE) D5.1(ANODE) D6.1(ANODE) J5.2 J27.2 J28.2 J29.2 R25.1 R26.2 R29.1 R30.2 R33.1 R34.2 R37.1 R38.2 U5.11(VSS)
AIN_: sheet Repeat(LED_AI,1,4)/Repeat(EN)
AIN_1: R23.1 R26.1  [project net ADC_IN1]
AIN_2: R27.1 R30.1  [project net ADC_IN2]
AIN_3: R31.1 R34.1  [project net ADC_IN3]
AIN_4: R35.1 R38.1  [project net ADC_IN4]
IN_1: F3.2 J5.1 R25.2
IN_2: F4.2 J27.1 R29.2
IN_3: F5.2 J28.1 R33.2
IN_4: F6.2 J29.1 R37.2
NetD3_2: D3.2(CATHODE) F3.1 U5.3(VIN+)
NetD4_2: D4.2(CATHODE) F4.1 U5.5(VIN+)
NetD5_2: D5.2(CATHODE) F5.1 U5.12(VIN+)
NetD6_2: D6.2(CATHODE) F6.1 U5.10(VIN+)
NetR23_2: R23.2 R24.2
NetR24_1: R24.1 U5.1(VOUT) U5.2(VIN-)
NetR27_2: R27.2 R28.2
NetR28_1: R28.1 U5.6(VIN-) U5.7(VOUT)
NetR31_2: R31.2 R32.2
NetR32_1: R32.1 U5.13(VIN-) U5.14(VOUT)
NetR35_2: R35.2 R36.2
NetR36_1: R36.1 U5.8(VOUT) U5.9(VIN-)

### Buses and harness runs
bus AIN_[1..4]
bus AIN_[1..4] = port AIN_[1..4]

### Notes on the sheet
- Buffers and Dividers
- (near F3) 470R termination for 4-20mA input. Sensors must support up to 20mA if 0-10V or 10mA if 0-5V.
- 12.66% voltage divider
- Connectors
- (near F4) 470R termination for 4-20mA input. Sensors must support up to 20mA if 0-10V or 10mA if 0-5V.
- (near F5) 470R termination for 4-20mA input. Sensors must support up to 20mA if 0-10V or 10mA if 0-5V.
- (near F6) 470R termination for 4-20mA input. Sensors must support up to 20mA if 0-10V or 10mA if 0-5V.
- FILE NAME
- PROJECT
- TITLE
- REV
- AUTHOR
- SIZE
- SHEET
- DATE
- OF
- A3

### Library data of the parts
D3-D6 = SMF22A: as D1 on sheet BrauV2_AnalogueOutput
F3-F6 = JK-NSMD005: as F1 on sheet BrauV2_AnalogueOutput
J5 J27-J29 = WJ2EDGRC-5.08-2P: as J3 on sheet BrauV2_AnalogueOutput
R23 R27 R31 R35 = 22K 0402 1% 1/16W: as R10 on sheet BrauV2_AnalogueOutput; Package: 0402; Tolerance: 1%; Power Rating: 1/16W
R24 R28 R32 R36 = 47K 0402 1% 1/16W: as R6 on sheet BrauV2_AnalogueOutput; Package: 0402; Tolerance: 1%; Power Rating: 1/16W
R25 R29 R33 R37 = 470R 2512 1% 1W: 470Ω ±1% 1W ±100ppm/℃ 2512 Chip Resistor - Surface Mount RoHS; Package: 2512; Tolerance: 1%; Power Rating: 1W
R26 R30 R34 R38 = 10K 0402 1% 1/16W: as R79 on sheet BrauV2_TopLevel; Package: 0402; Tolerance: 1%; Power Rating: 1/16W
U5 = LM324DTBR2G: as U1 on sheet BrauV2_AnalogueOutput

## Sheet BrauV2_Display.SchDoc
size 420 x 297 mm; PageSetup: Record=PageOptions|CenterHorizontal=True|CenterVertical=True|PrintScale=1.01|XCorrection=1.00|YCorrection=1.00|PrintKind=1|BorderSize=5000000|LeftOffset=0|BottomOffset=0|Orientation=2|PaperLength=1000|PaperWidth=1000|Scale=100|PaperSource=7|PrintQuality=-4|MediaType=1|DitherType=10|PaperKind=A3|PrintScaleMode=1; DocumentNumber: 7; SheetNumber: 7; SheetTotal: 22
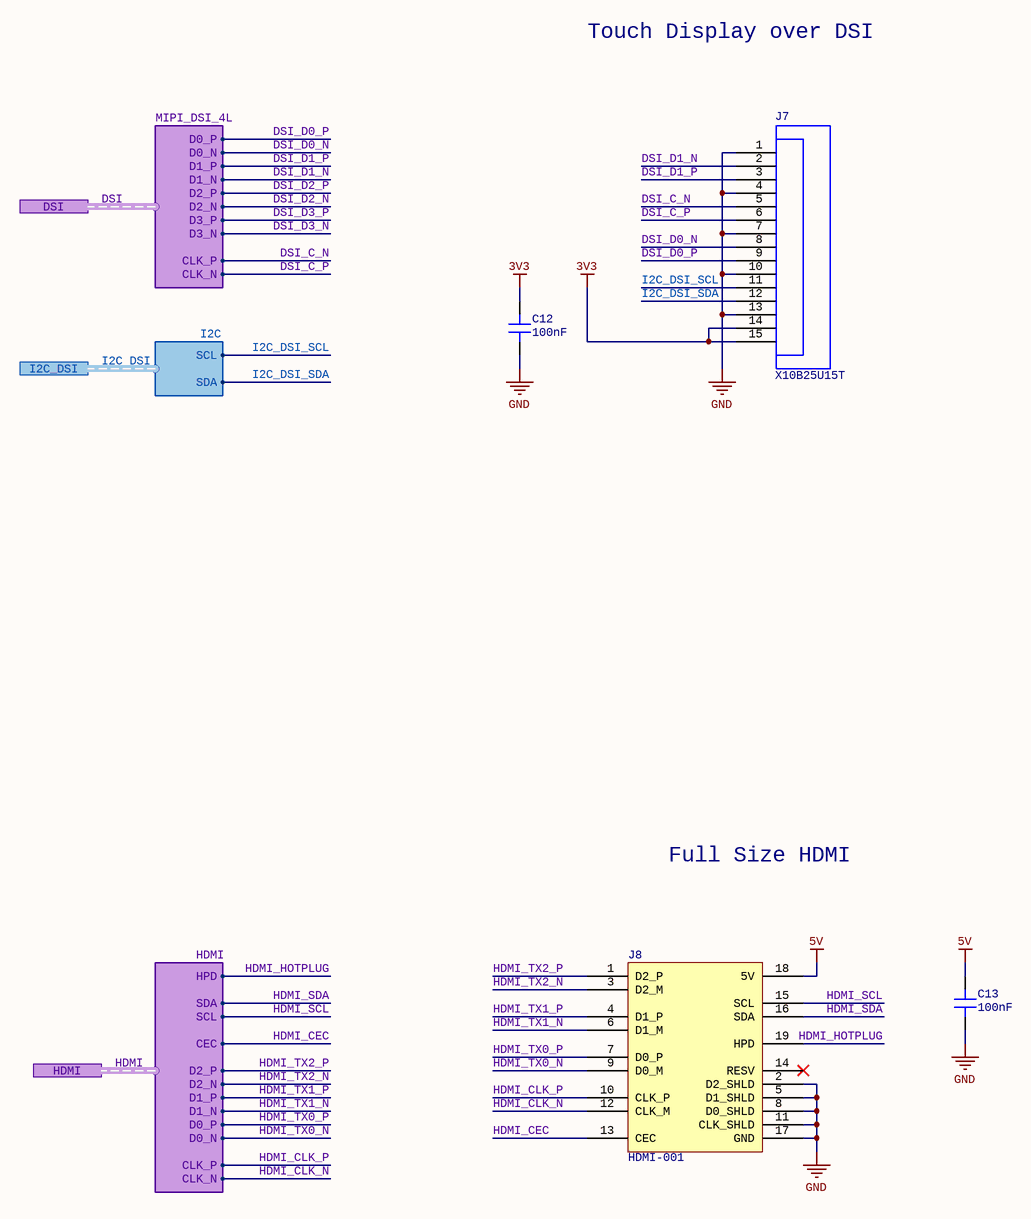
[diagram p7: BrauV2_Display.SchDoc]

### Parts
C12  Capacitance: 100nF  [SMD_CAP_0402(1005)_N]  (hidden comment: CC0402KRX5R6BB104)
C13  Capacitance: 100nF  [SMD_CAP_0402(1005)_N]  (hidden comment: CC0402KRX5R6BB104)
J7  X10B25U15T  [X10B25U15T]
J8  HDMI-001  [HDMI-001]

### Ports
DSI (harness MIPI_DSI_4L), HDMI (harness HDMI), I2C_DSI (harness I2C)

### Harnesses
HDMI: CLK_P, CLK_N, D0_P, D0_N, D2_N, D2_P, D1_N, D1_P, CEC, HPD, SDA, SCL
MIPI_DSI_4L: D1_N, D1_P, D0_P, D0_N, CLK_P, CLK_N, D2_N, D2_P, D3_N, D3_P
I2C: SCL, SDA

### Nets
3V3: C12.2 J7.14 J7.15
5V: C13.2 J8.18(5V)
GND: C12.1 C13.1 J7.1 J7.4 J7.7 J7.10 J7.13 J8.2(D2_SHLD) J8.5(D1_SHLD) J8.8(D0_SHLD) J8.11(CLK_SHLD) J8.17(GND)
DSI_C_N: J7.5 ; port DSI.CLK_P  [project net DSI.CLK_P]
DSI_C_P: J7.6 ; port DSI.CLK_N  [project net DSI.CLK_N]
DSI_D0_N: J7.8 ; port DSI.D0_N  [project net DSI.D0_N]
DSI_D0_P: J7.9 ; port DSI.D0_P  [project net DSI.D0_P]
DSI_D1_N: J7.2 ; port DSI.D1_N  [project net DSI.D1_N]
DSI_D1_P: J7.3 ; port DSI.D1_P  [project net DSI.D1_P]
DSI_D2_N: port DSI.D2_N  [project net DSI.D2_N]
DSI_D2_P: port DSI.D2_P  [project net DSI.D2_P]
DSI_D3_N: port DSI.D3_N  [project net DSI.D3_N]
DSI_D3_P: port DSI.D3_P  [project net DSI.D3_P]
HDMI_CEC: J8.13(CEC) ; port HDMI.CEC  [project net HDMI.CEC]
HDMI_CLK_N: J8.12(CLK_M) ; port HDMI.CLK_N  [project net HDMI.CLK_N]
HDMI_CLK_P: J8.10(CLK_P) ; port HDMI.CLK_P  [project net HDMI.CLK_P]
HDMI_HOTPLUG: J8.19(HPD) ; port HDMI.HPD  [project net HDMI.HPD]
HDMI_SCL: J8.15(SCL) ; port HDMI.SCL  [project net HDMI.SCL]
HDMI_SDA: J8.16(SDA) ; port HDMI.SDA  [project net HDMI.SDA]
HDMI_TX0_N: J8.9(D0_M) ; port HDMI.D0_N  [project net HDMI.D0_N]
HDMI_TX0_P: J8.7(D0_P) ; port HDMI.D0_P  [project net HDMI.D0_P]
HDMI_TX1_N: J8.6(D1_M) ; port HDMI.D1_N  [project net HDMI.D1_N]
HDMI_TX1_P: J8.4(D1_P) ; port HDMI.D1_P  [project net HDMI.D1_P]
HDMI_TX2_N: J8.3(D2_M) ; port HDMI.D2_N  [project net HDMI.D2_N]
HDMI_TX2_P: J8.1(D2_P) ; port HDMI.D2_P  [project net HDMI.D2_P]
I2C_DSI_SCL: J7.11 ; port I2C_DSI.SCL  [project net I2C_DSI.SCL]
I2C_DSI_SDA: J7.12 ; port I2C_DSI.SDA  [project net I2C_DSI.SDA]

Not connected (* = marked no-connect by the designer): J8 14(RESV)*

### Buses and harness runs
harness DSI = port DSI
harness HDMI = port HDMI
harness I2C_DSI = port I2C_DSI

### Notes on the sheet
- Touch Display over DSI
- Full Size HDMI
- FILE NAME
- PROJECT
- TITLE
- REV
- AUTHOR
- SIZE
- SHEET
- DATE
- OF
- A3

### Library data of the parts
C12 C13 = 100nF 0402 10V 10%: as C3 on sheet BrauV2_AnalogueOutput; Package: 0402; Tolerance: 10%; Voltage Rating: 10V
J7 = X10B25U15T: Contact,Top 15 0.039"（1.00mm） 0.098"（2.50mm） Slide Lock SMD FFC, FPC Connectors RoHS
J8 = HDMI-001: BOOMELE(Boom Precision Elec) HDMIconnector 19 Female Horizontal SMD Audio & Video Connectors RoHS

## Sheet BrauV2_Etherent.SchDoc
size 420 x 297 mm; PageSetup: Record=PageOptions|CenterHorizontal=True|CenterVertical=True|PrintScale=1.01|XCorrection=1.00|YCorrection=1.00|PrintKind=1|BorderSize=5000000|LeftOffset=0|BottomOffset=0|Orientation=2|PaperLength=1000|PaperWidth=1000|Scale=100|PaperSource=7|PrintQuality=-4|MediaType=1|DitherType=10|PaperKind=A3|PrintScaleMode=1; DocumentNumber: 9; SheetNumber: 9; SheetTotal: 22
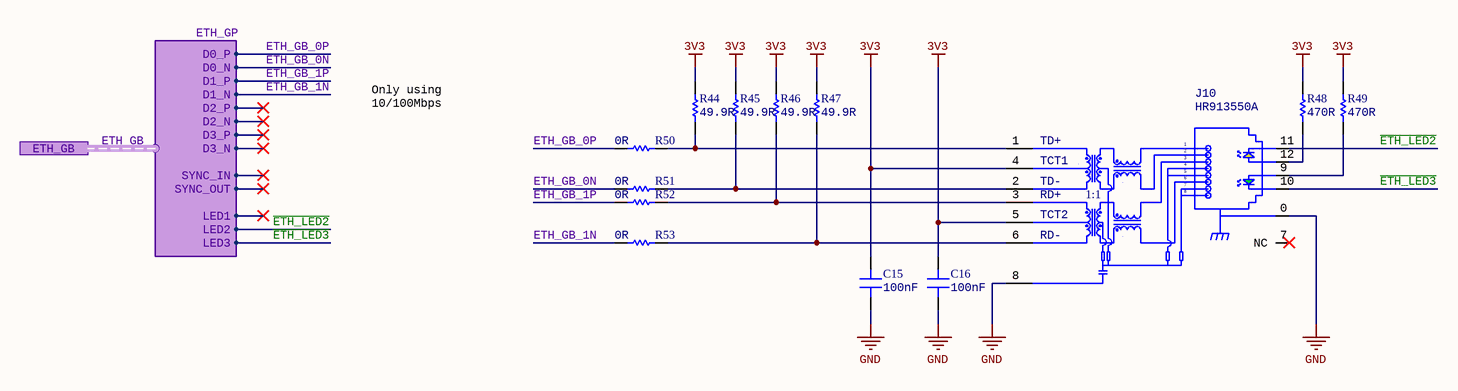
[diagram p8: BrauV2_Etherent.SchDoc]

### Parts
C15  Capacitance: 100nF  [SMD_CAP_0402(1005)_N]  (hidden comment: CC0402KRX5R9BB104)
C16  Capacitance: 100nF  [SMD_CAP_0402(1005)_N]  (hidden comment: CC0402KRX5R9BB104)
J10  HR913550A  [HR913550A]
R44  Resistance: 49.9R  [SMD_RES_0402(1005)_N]  (hidden comment: RC0402FR-0749R9L)
R45  Resistance: 49.9R  [SMD_RES_0402(1005)_N]  (hidden comment: RC0402FR-0749R9L)
R46  Resistance: 49.9R  [SMD_RES_0402(1005)_N]  (hidden comment: RC0402FR-0749R9L)
R47  Resistance: 49.9R  [SMD_RES_0402(1005)_N]  (hidden comment: RC0402FR-0749R9L)
R48  Resistance: 470R  [SMD_RES_0402(1005)_N]  (hidden comment: RC0402FR-07470RL)
R49  Resistance: 470R  [SMD_RES_0402(1005)_N]  (hidden comment: RC0402FR-07470RL)
R50  Resistance: 0R  [SMD_RES_0402(1005)_N]  (hidden comment: RC0402FR-070RL)
R51  Resistance: 0R  [SMD_RES_0402(1005)_N]  (hidden comment: RC0402FR-070RL)
R52  Resistance: 0R  [SMD_RES_0402(1005)_N]  (hidden comment: RC0402FR-070RL)
R53  Resistance: 0R  [SMD_RES_0402(1005)_N]  (hidden comment: RC0402FR-070RL)

### Ports
ETH_GB (harness ETH_GP)

### Harnesses
ETH_GP: D0_P, D0_N, D1_P, D1_N, D2_P, D2_N, D3_P, D3_N, SYNC_IN, SYNC_OUT, LED1, LED2, LED3

### Nets
3V3: C15.2 C16.2 J10.4(TCT1) J10.5(TCT2) R44.2 R45.2 R46.2 R47.2 R48.2 R49.2
GND: C15.1 C16.1 J10.0(SHLD) J10.8(GND)
~{ETH_LED2}: J10.11(YLED-) ; port ETH_GB.LED2
~{ETH_LED3}: J10.10(GLED+) ; port ETH_GB.LED3
ETH_GB_0N: R51.1 ; port ETH_GB.D0_N  [project net ETH_GB.D0_N]
ETH_GB_0P: R50.1 ; port ETH_GB.D0_P  [project net ETH_GB.D0_P]
ETH_GB_1N: R53.1 ; port ETH_GB.D1_N  [project net ETH_GB.D1_N]
ETH_GB_1P: R52.1 ; port ETH_GB.D1_P  [project net ETH_GB.D1_P]
NetJ10_1: J10.1(TD+) R44.1 R50.2
NetJ10_2: J10.2(TD-) R45.1 R51.2
NetJ10_3: J10.3(RD+) R46.1 R52.2
NetJ10_6: J10.6(RD-) R47.1 R53.2
NetJ10_9: J10.9(OLED+) R49.1
NetJ10_12: J10.12(YLED+) R48.1

Not connected (* = marked no-connect by the designer): J10 7(NC)*

### Buses and harness runs
harness ETH_GB = port ETH_GB

### Notes on the sheet
- Only using 10/100Mbps
- FILE NAME
- PROJECT
- TITLE
- REV
- AUTHOR
- SIZE
- SHEET
- DATE
- OF
- A3
- (in symbol HR913550A) 1:1

### Library data of the parts
C15 C16 = 100nF 0402 50V 10%: as C2 on sheet BrauV2_AnalogueOutput; Package: 0402; Tolerance: 10%; Voltage Rating: 50V
J10 = HR913550A: RJ45 12 1 Green - Yellow Through Hole Ethernet Connectors/Modular Connectors (RJ45 RJ11) RoHS
R44-R47 = 49R9 0402 1% 1/16W: 49.9Ω ±1% 1/16W ±100ppm/℃ 0402 Chip Resistor - Surface Mount RoHS; Package: 0402; Tolerance: 1%; Power Rating: 1/16W
R48 R49 = 470R 0402 1% 1W: as R43 on sheet BrauV2_ComputeModule; Package: 0402; Tolerance: 1%
R50-R53 = 0R 0402 1% 1/16W: as R90 on sheet BrauV2_ComputeModule; Package: 0402; Tolerance: 1%; Power Rating: 1/16W